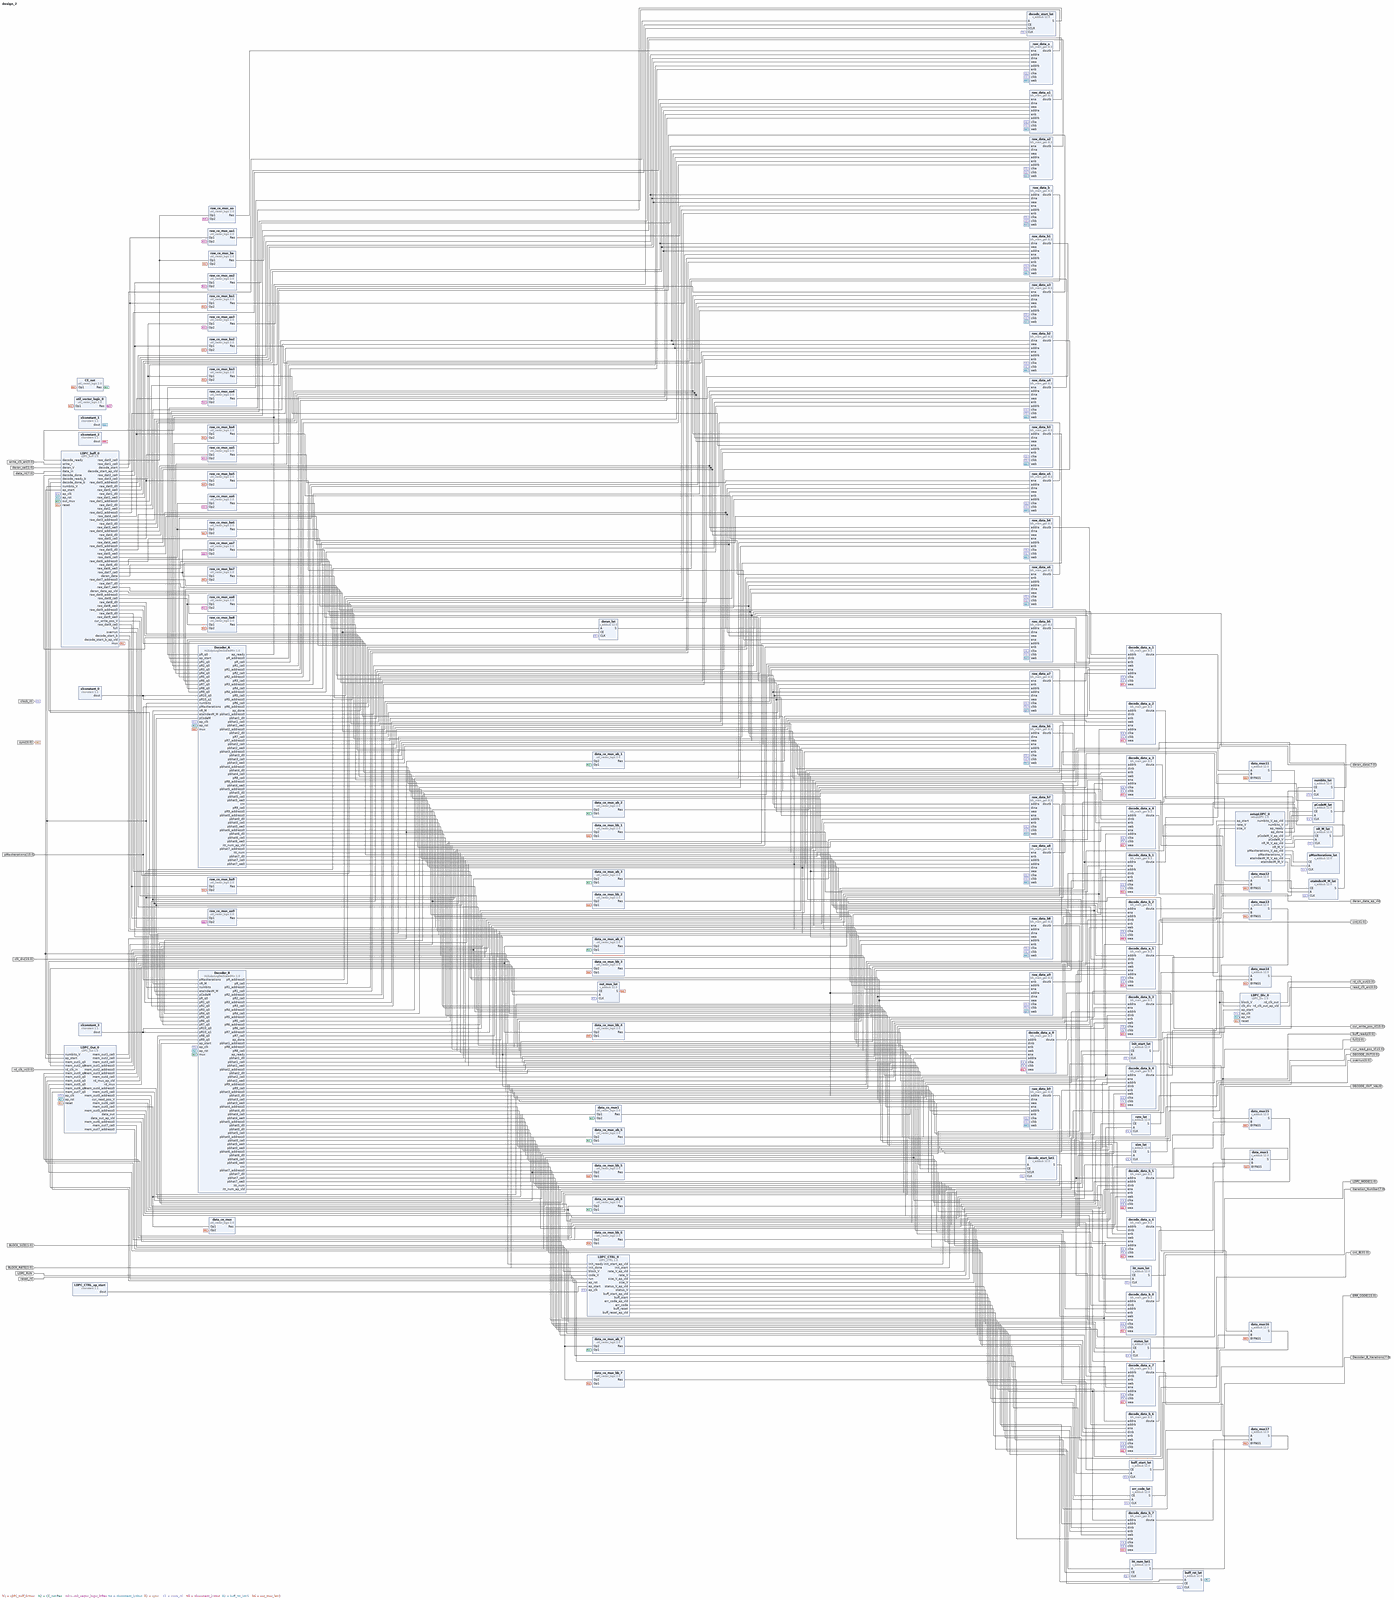
[diagram p0: block diagram of the top level, whole]
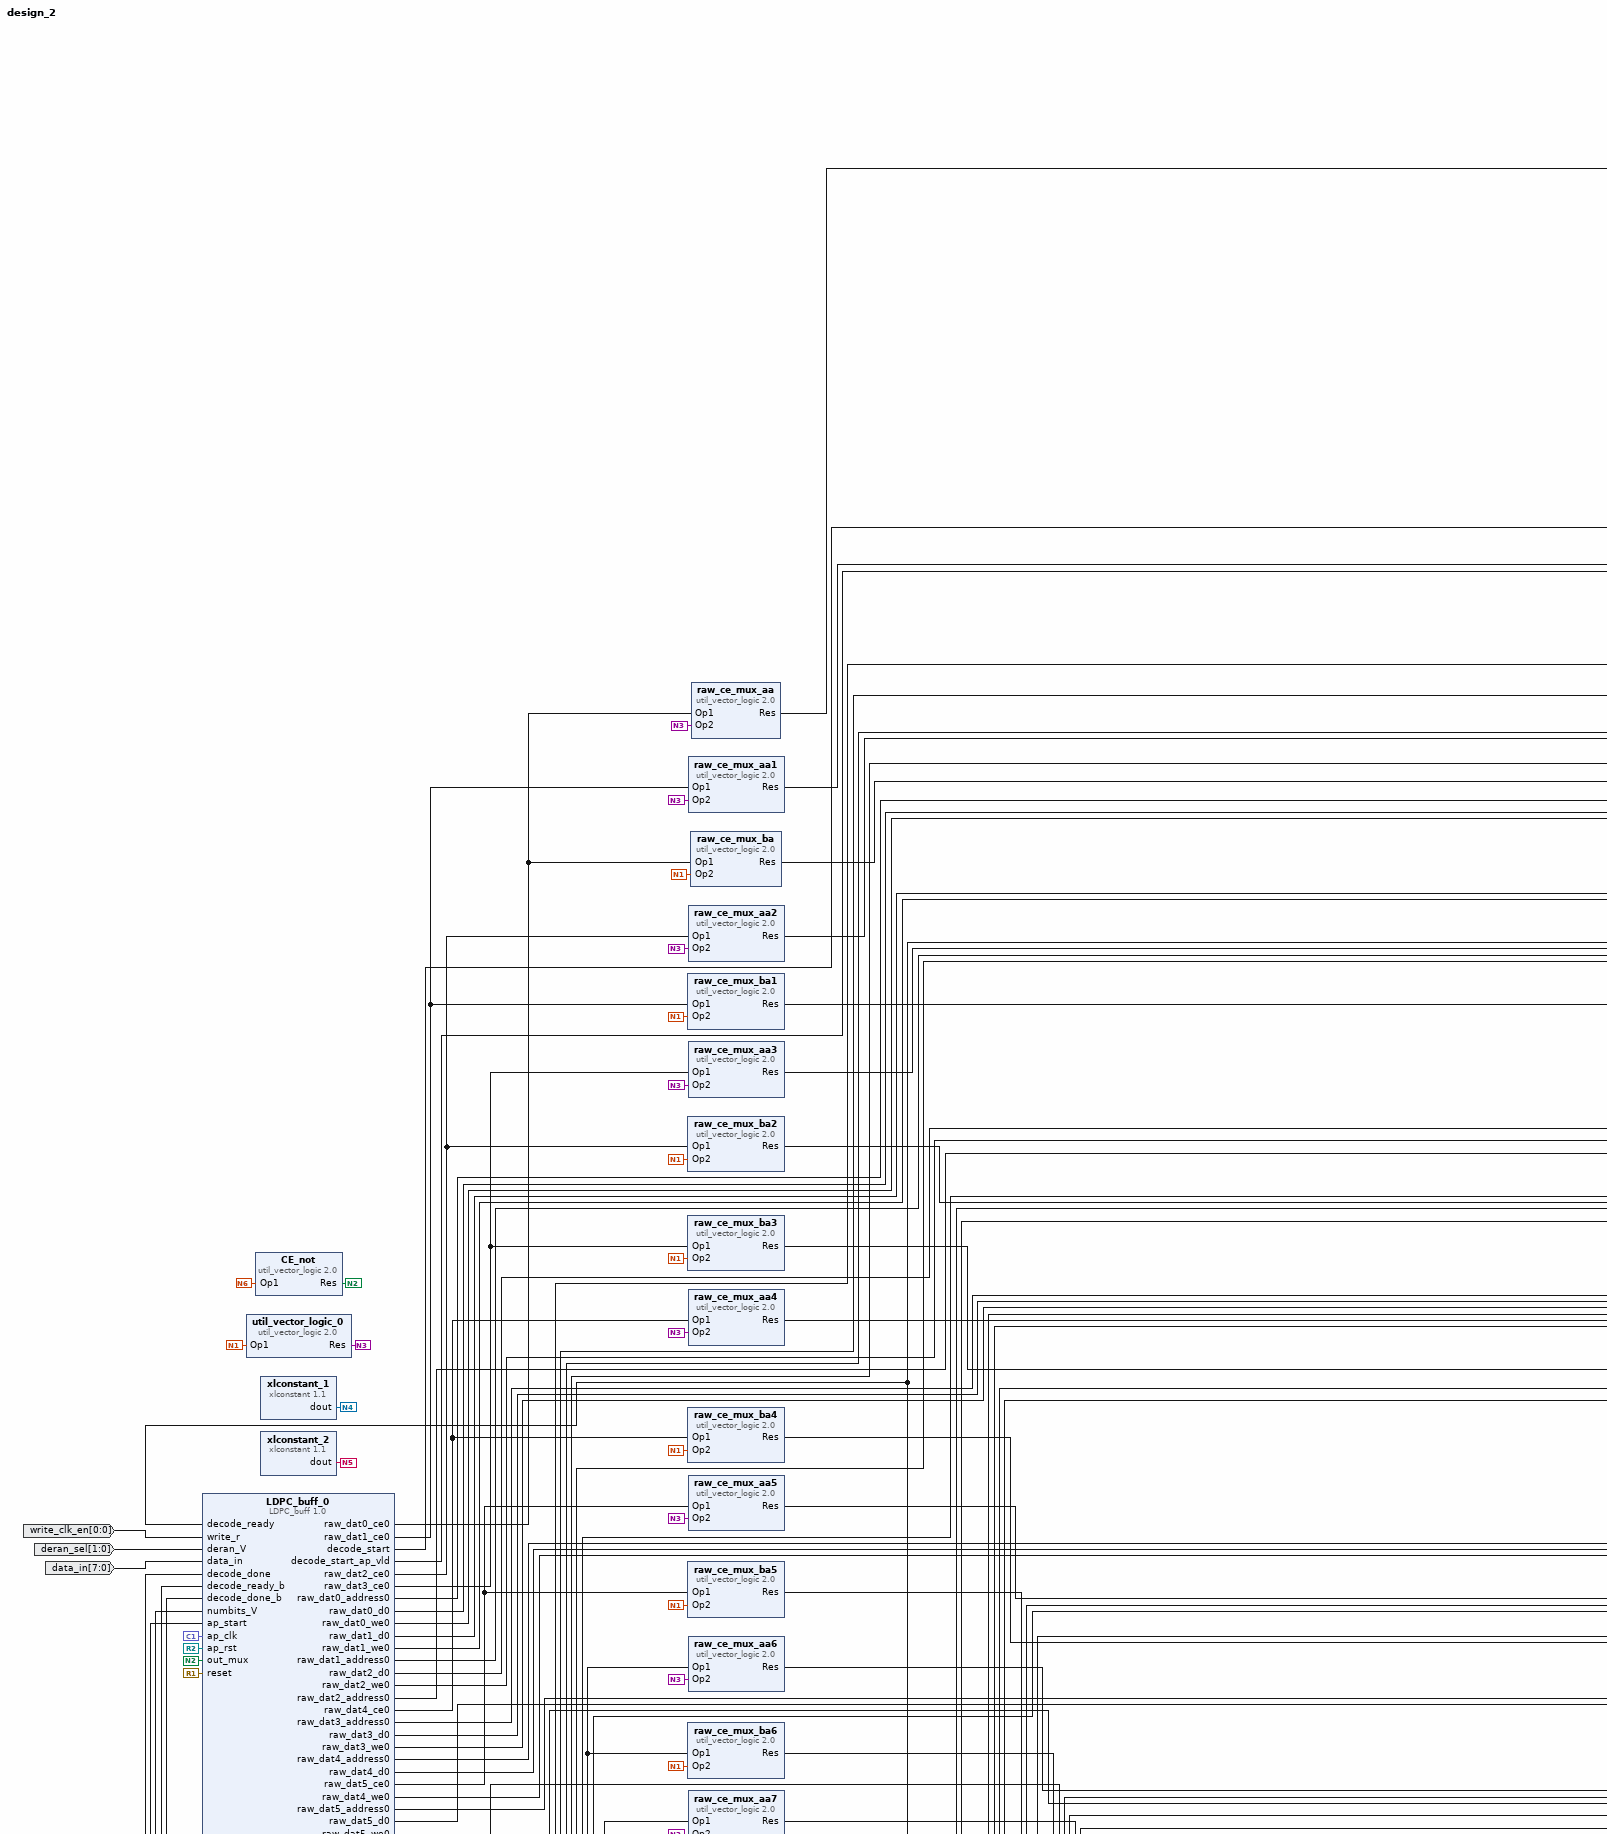
[diagram p1: block diagram of the top level, upper left part]
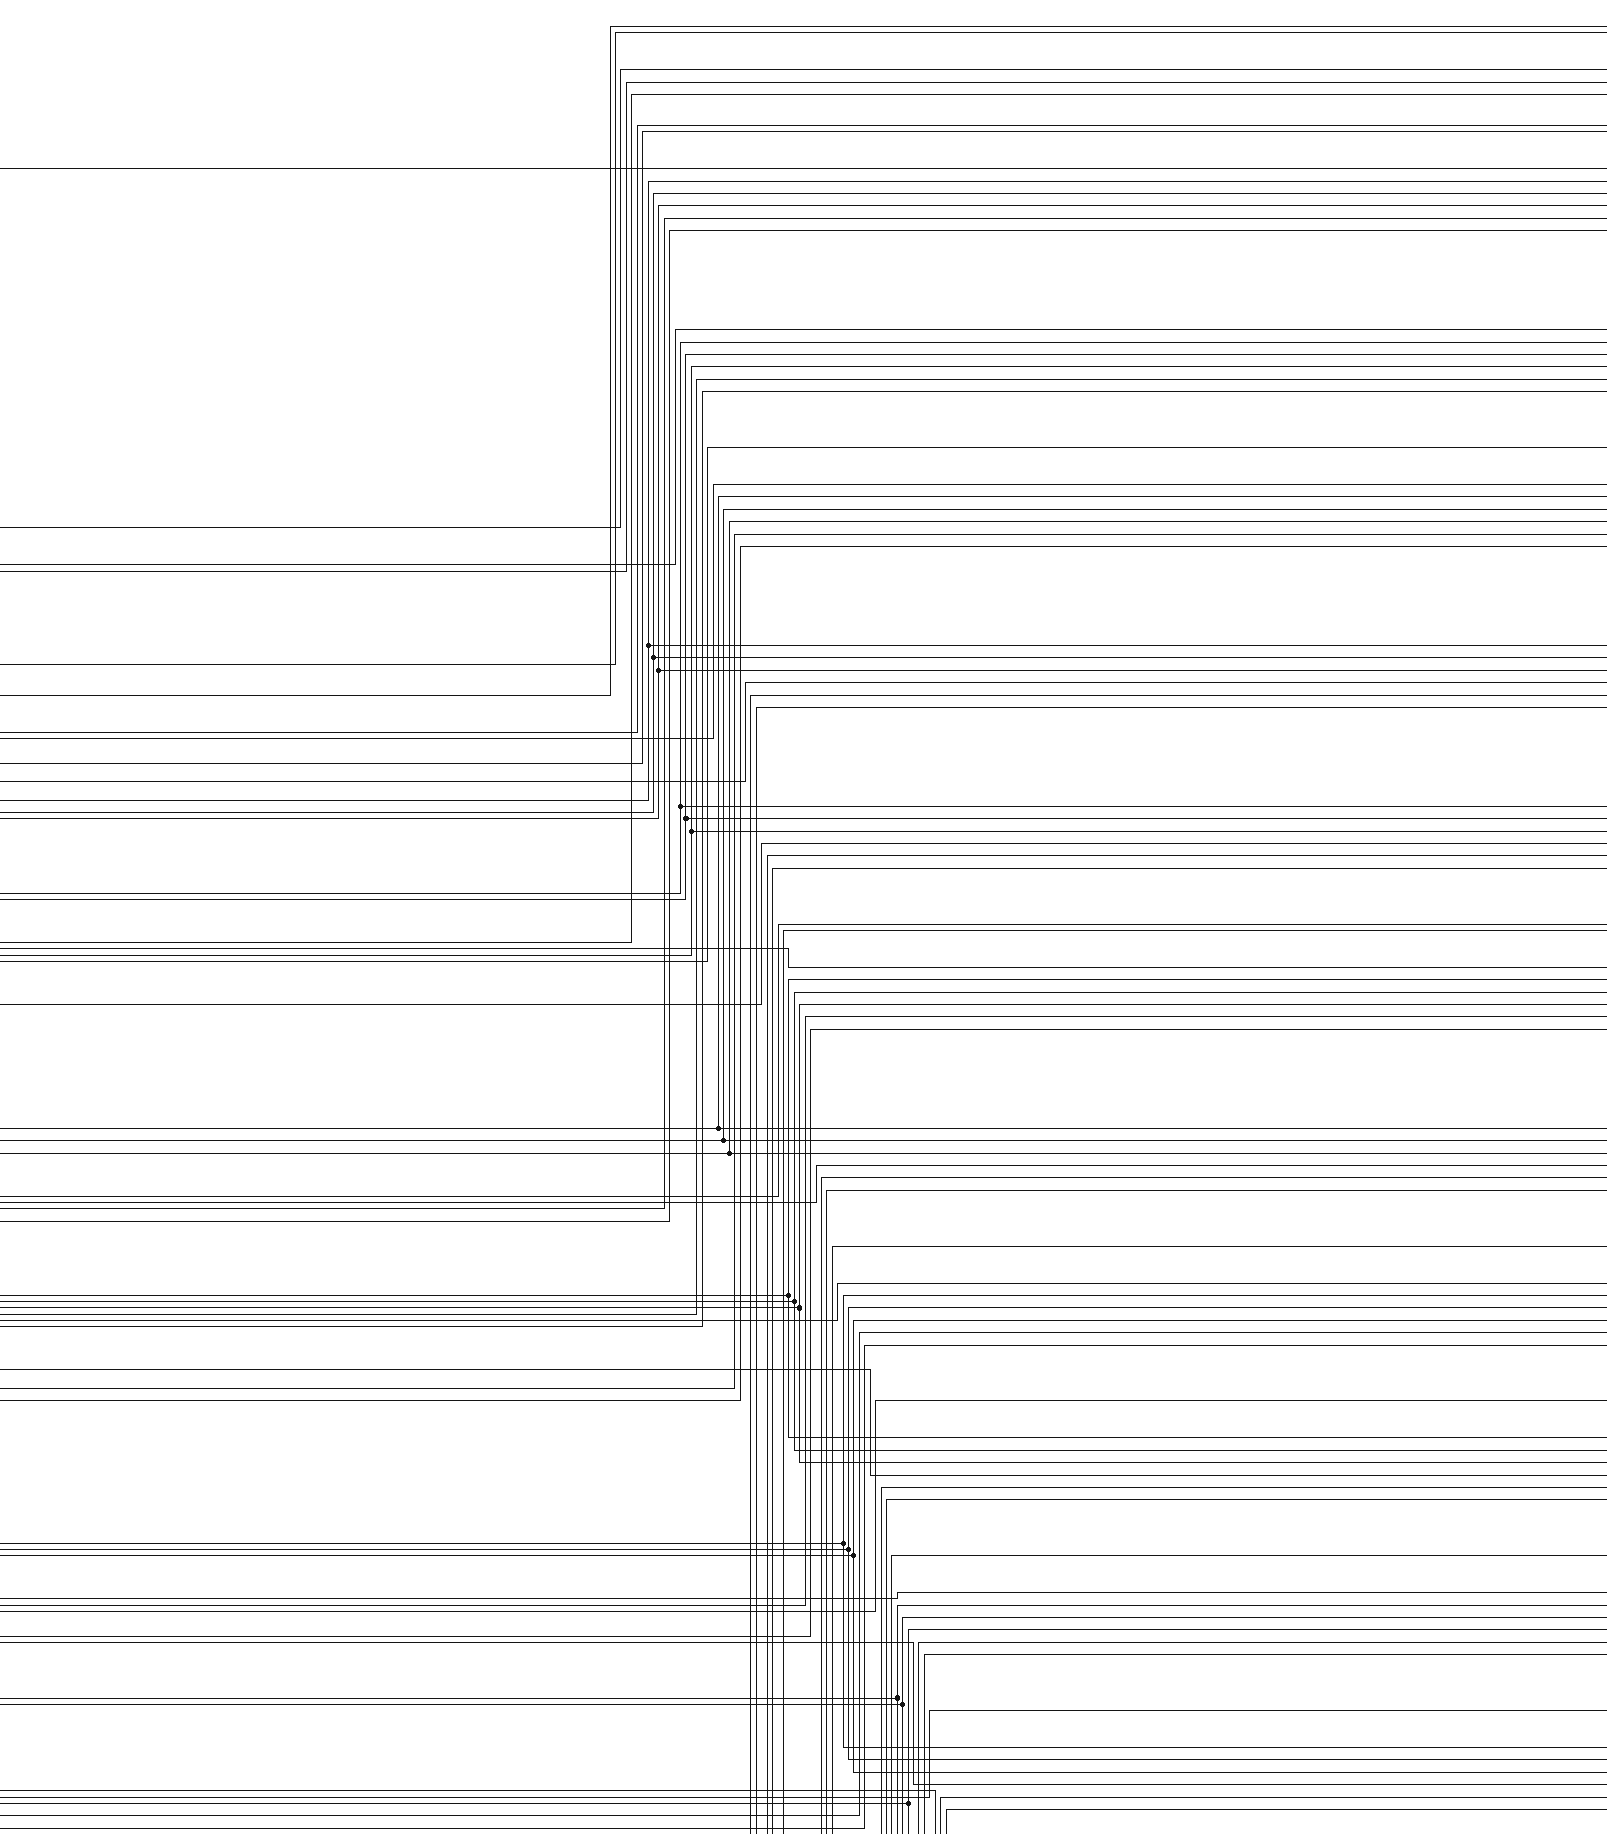
[diagram p2: block diagram of the top level, upper centre part]
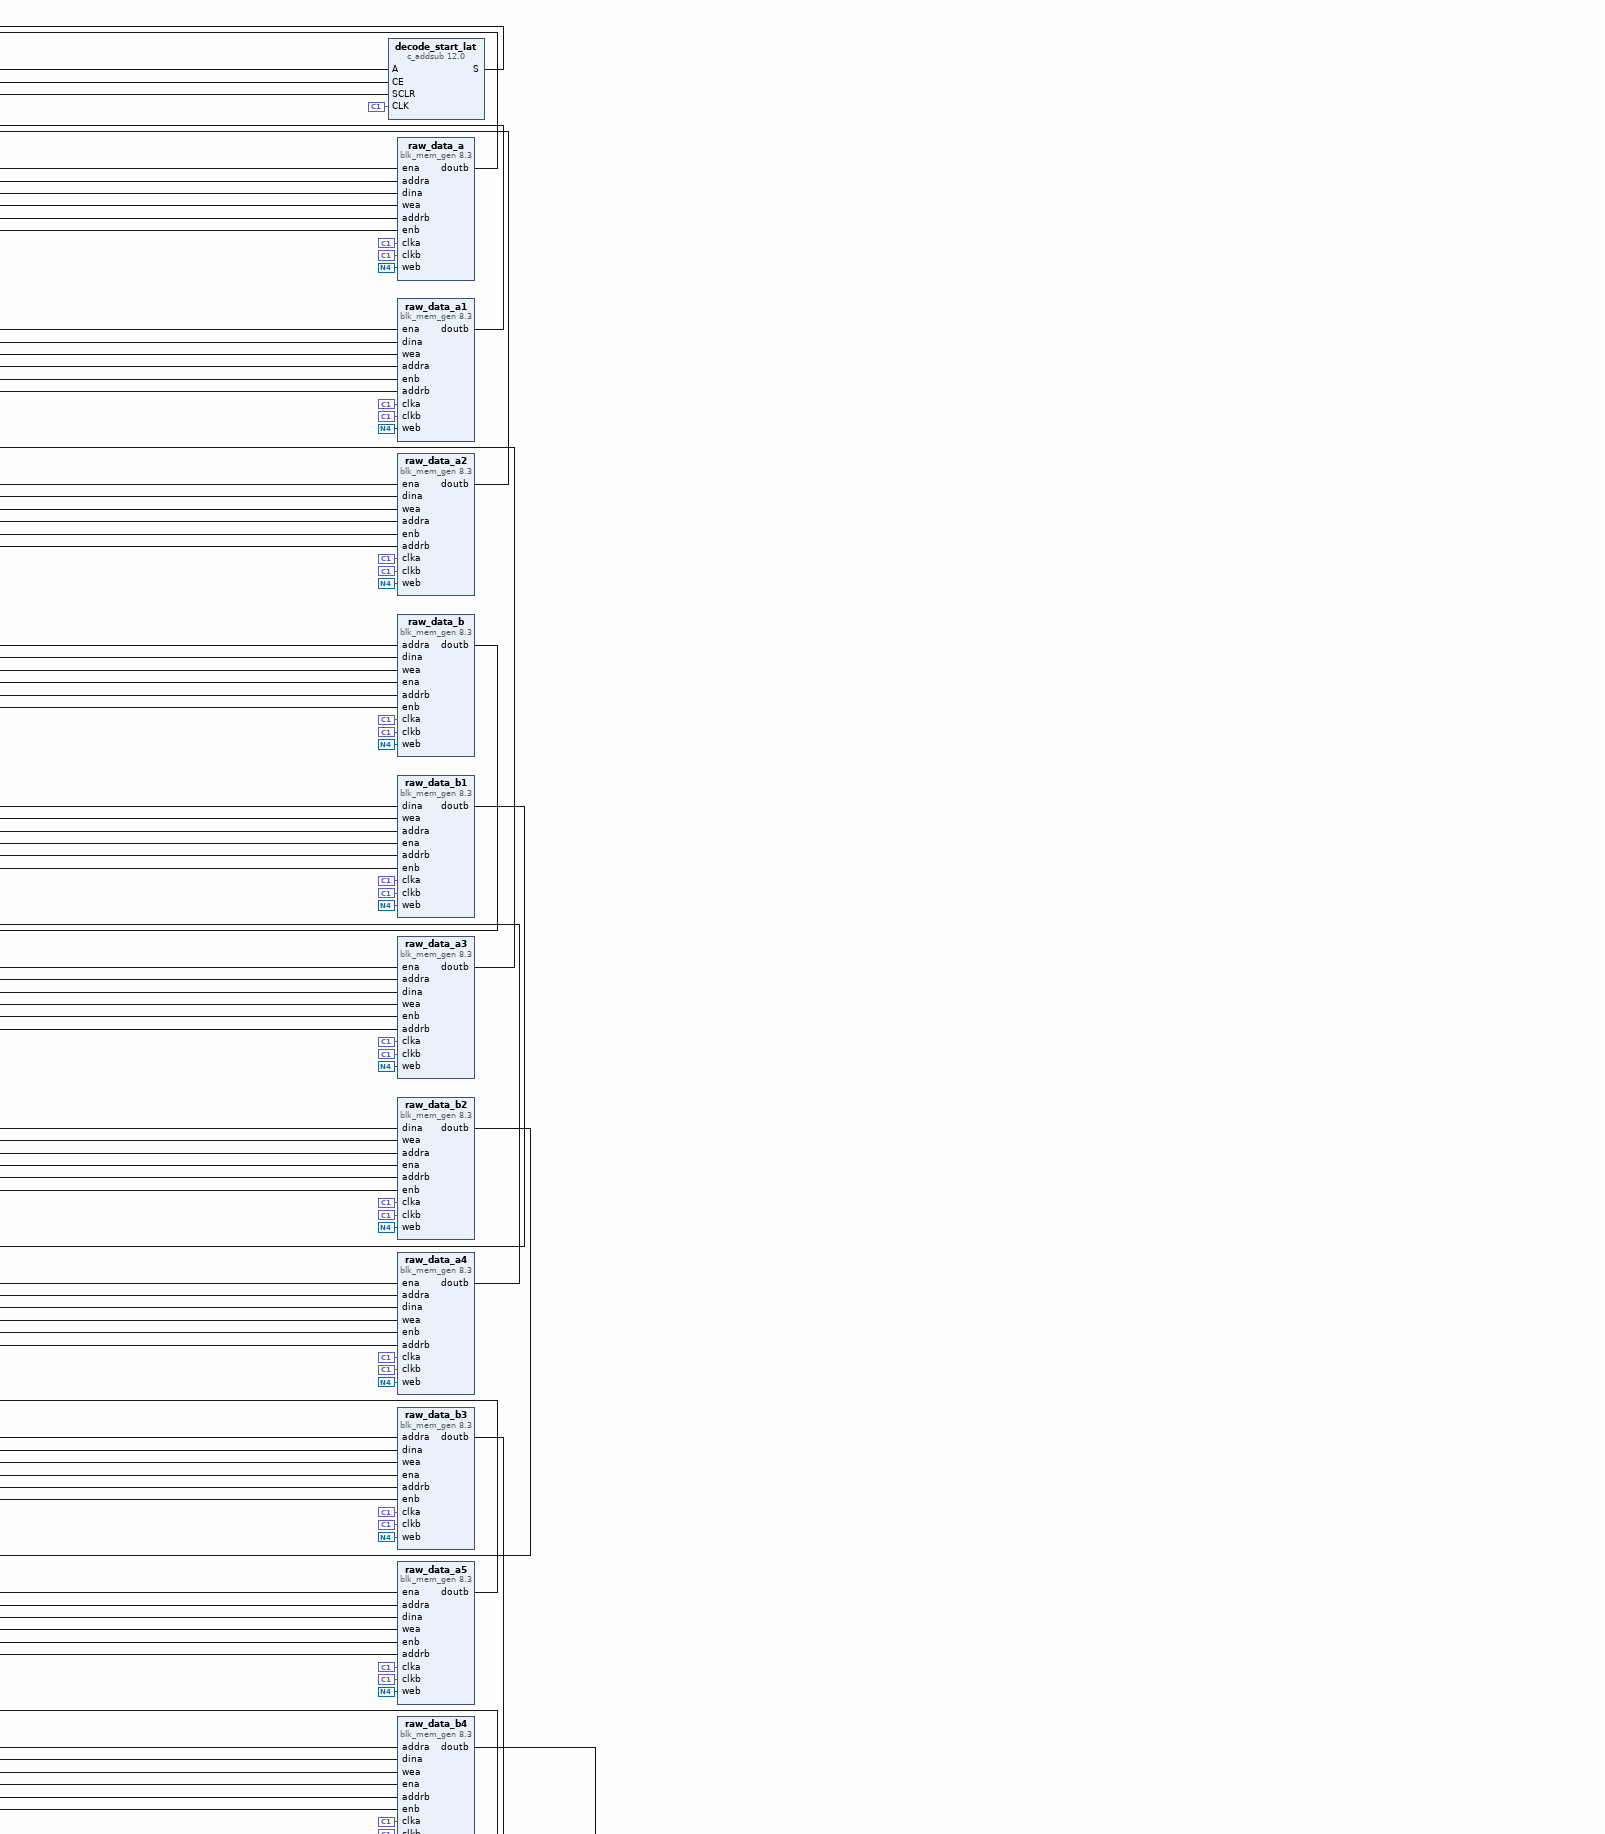
[diagram p3: block diagram of the top level, upper right part]
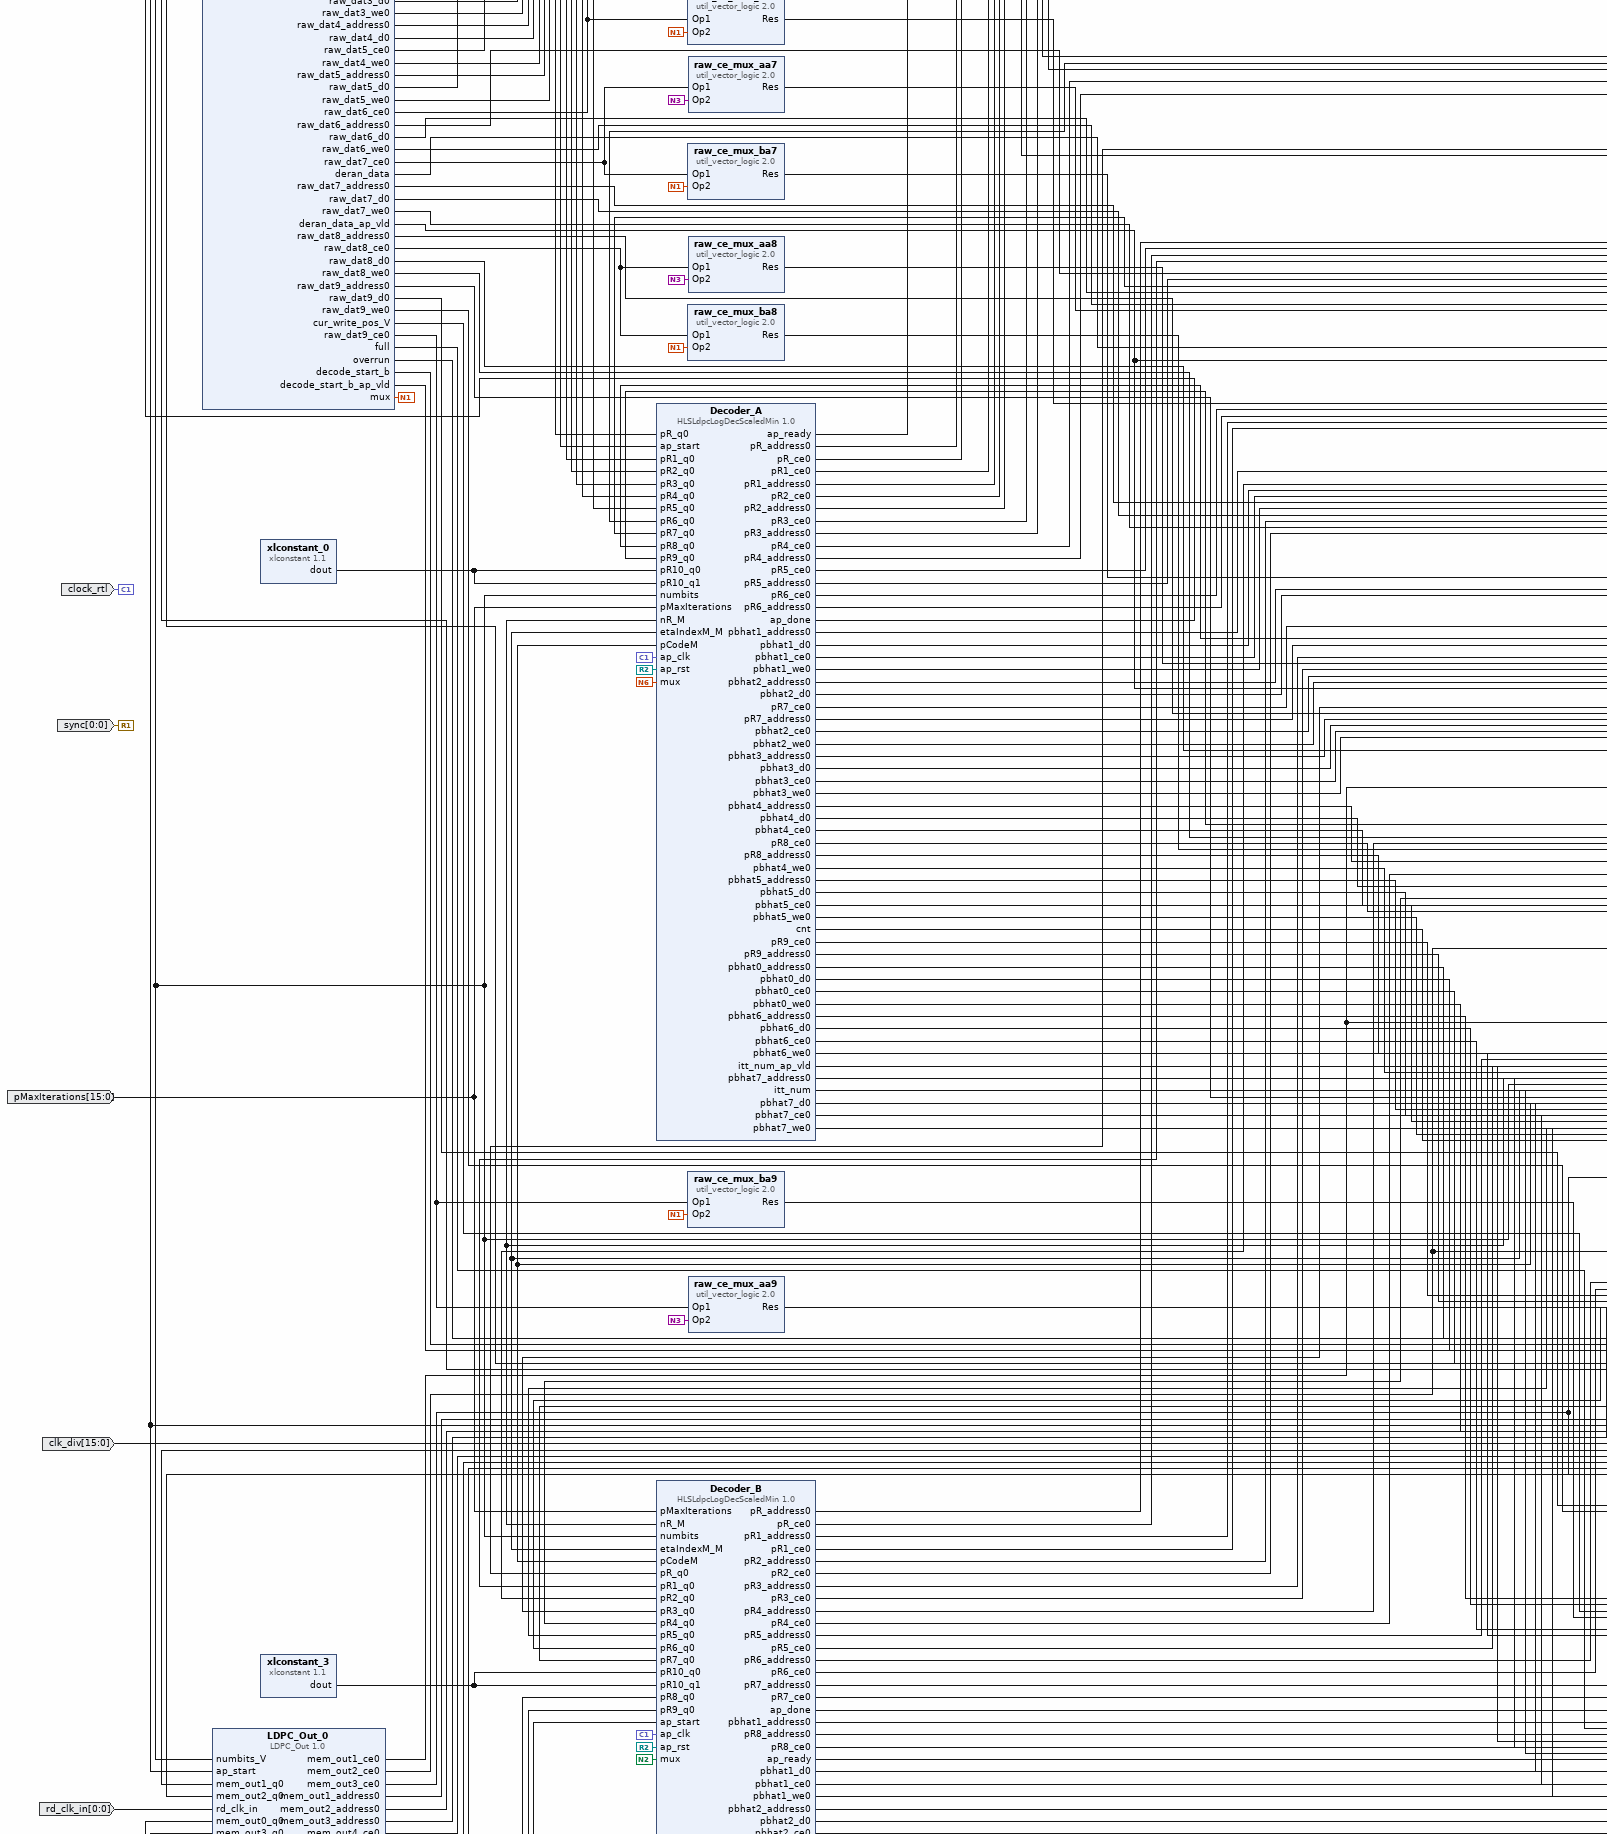
[diagram p4: block diagram of the top level, middle left part]
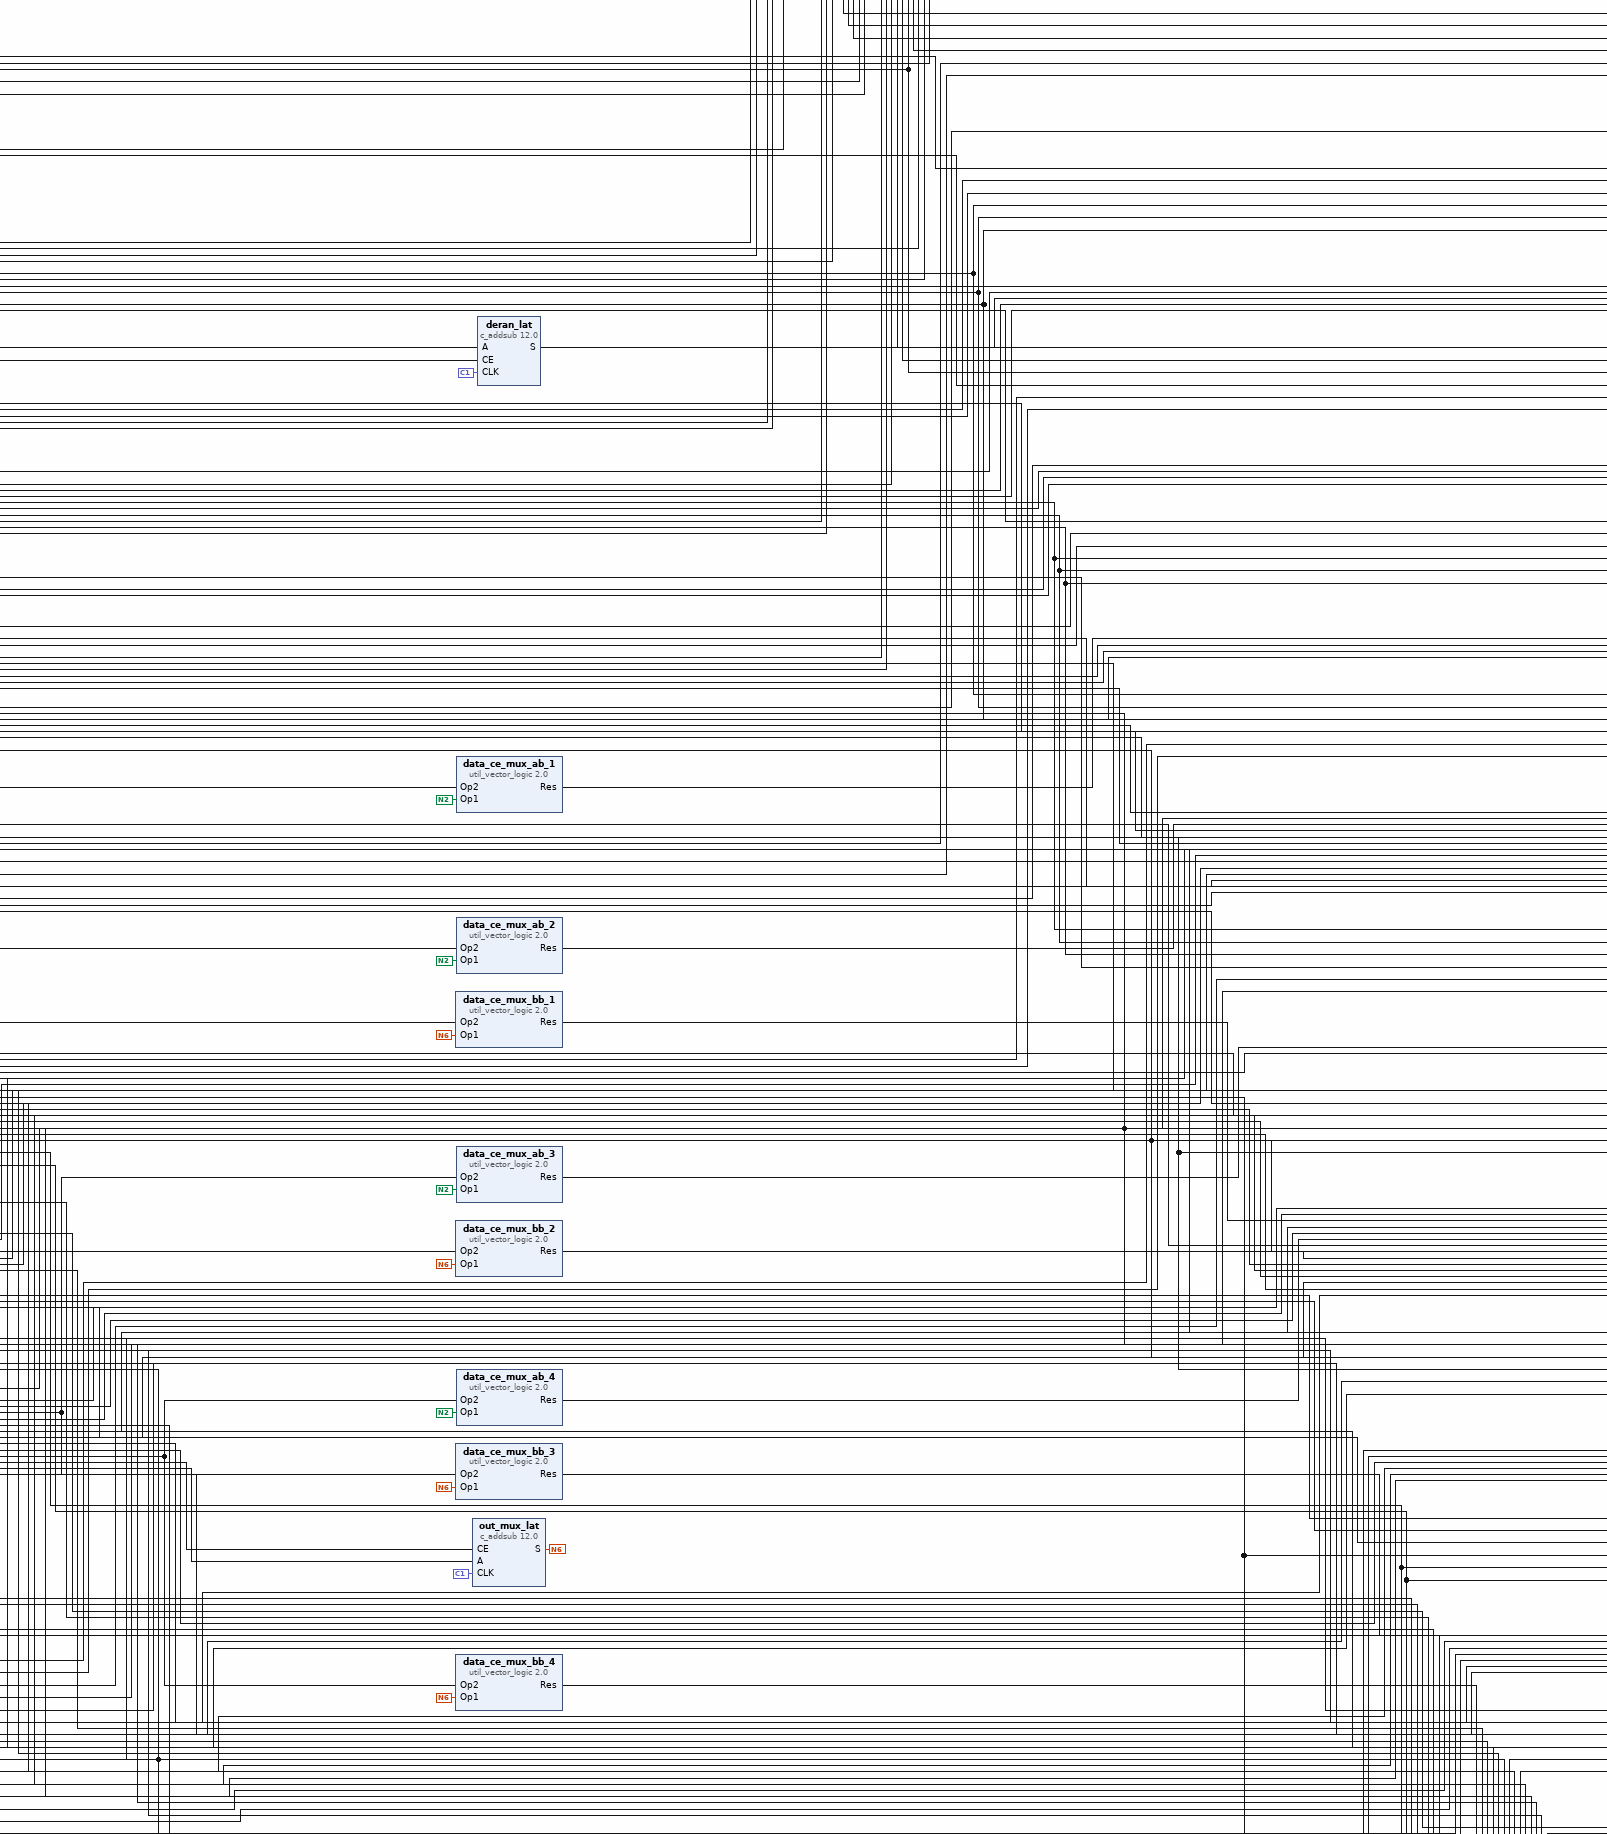
[diagram p5: block diagram of the top level, middle centre part]
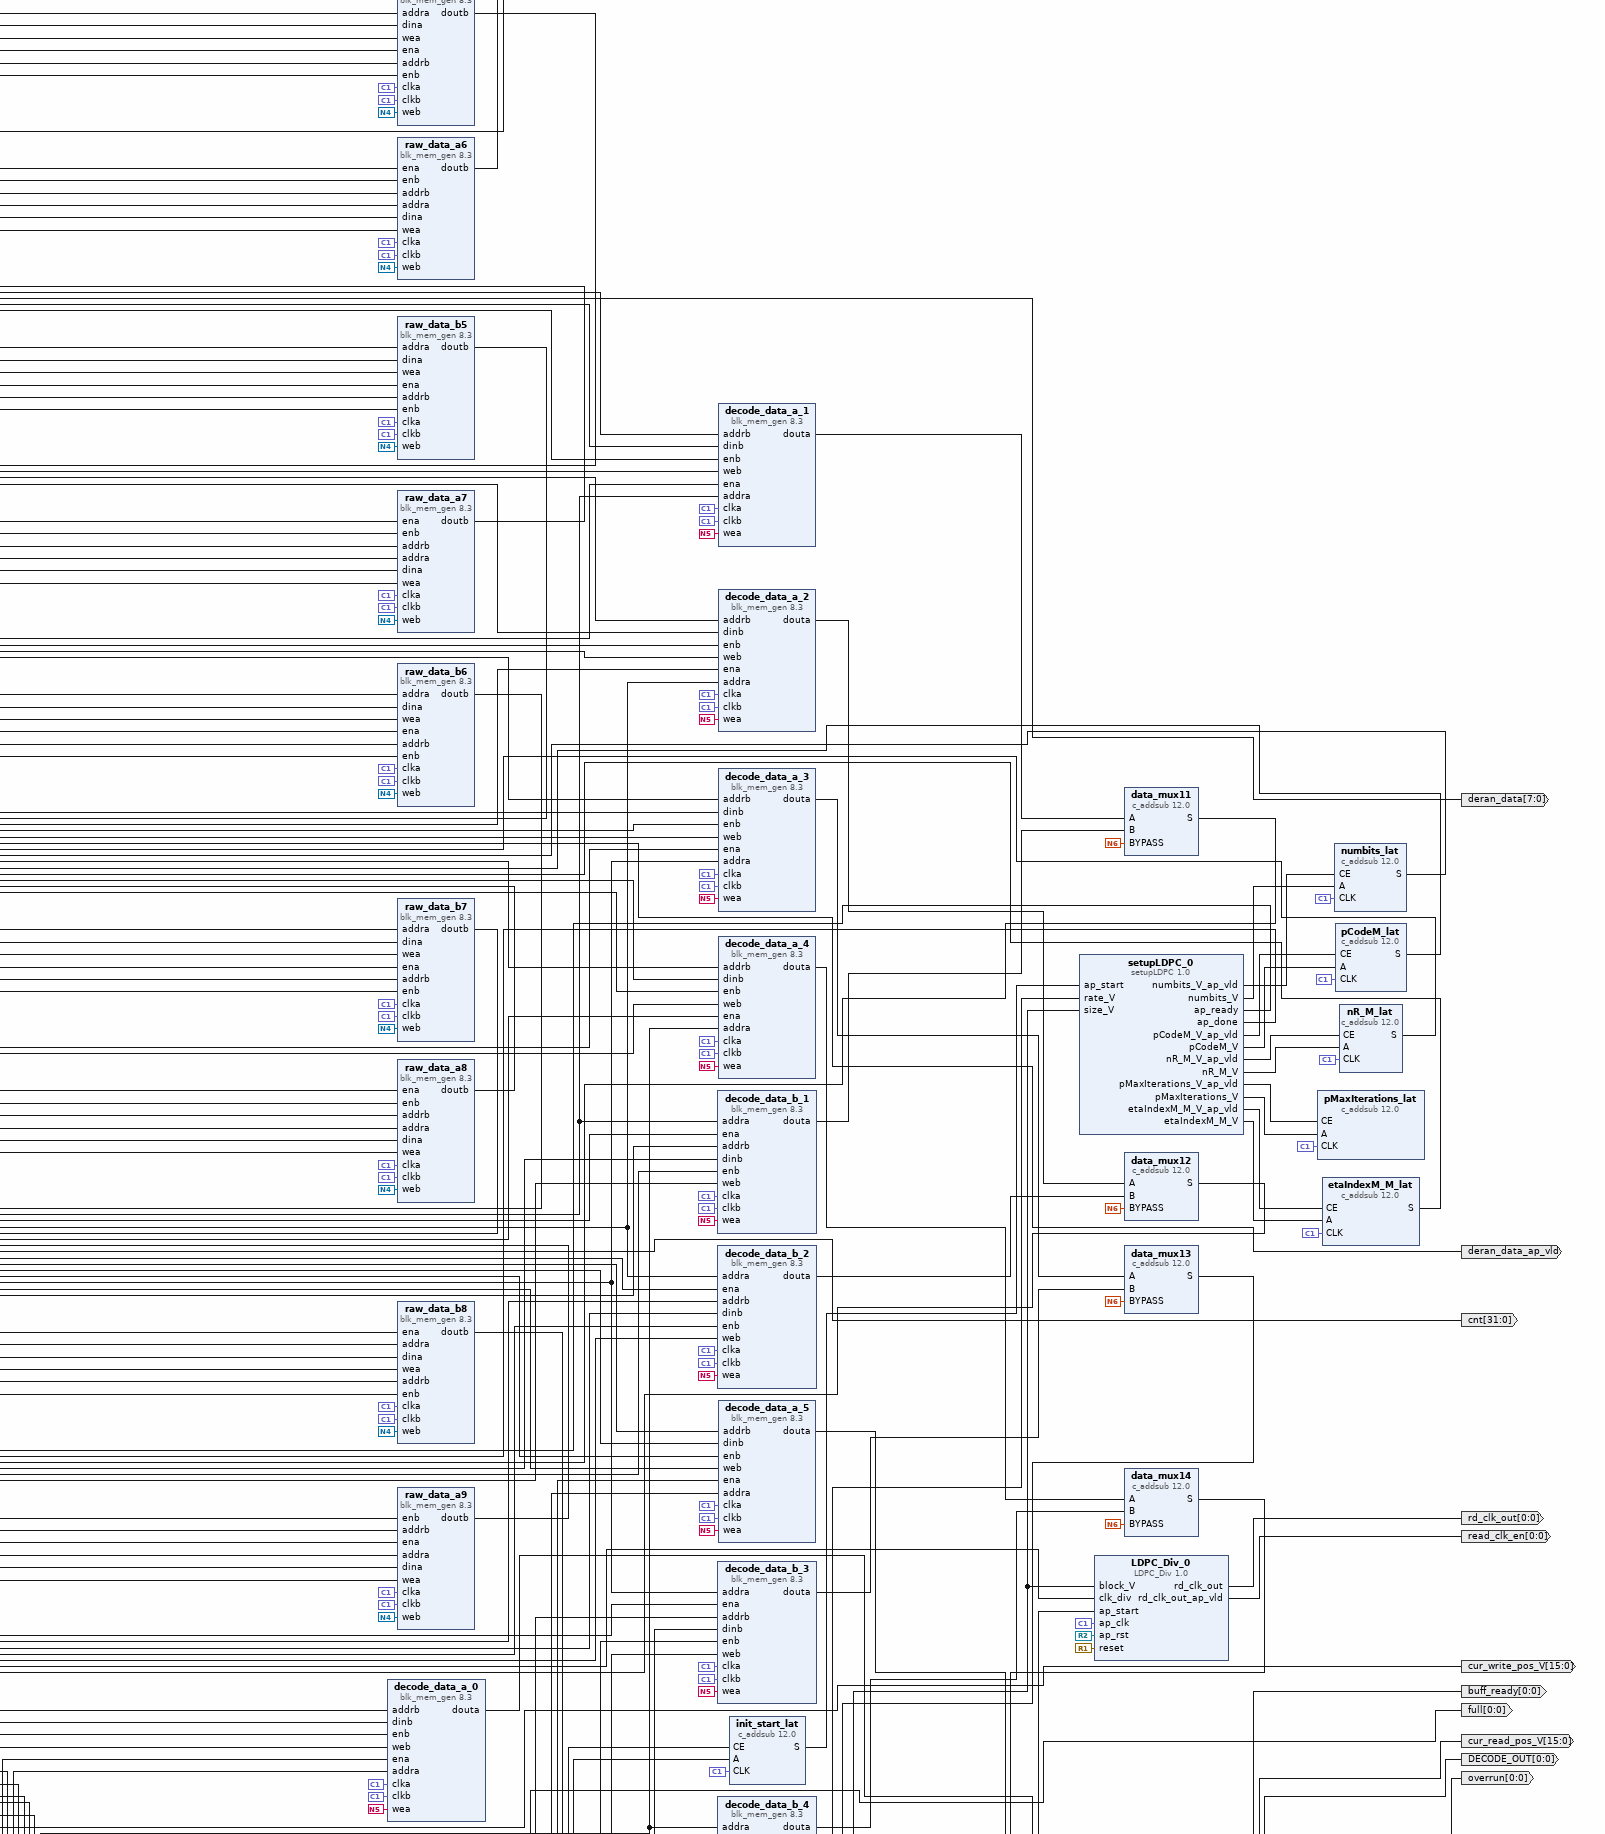
[diagram p6: block diagram of the top level, middle right part]
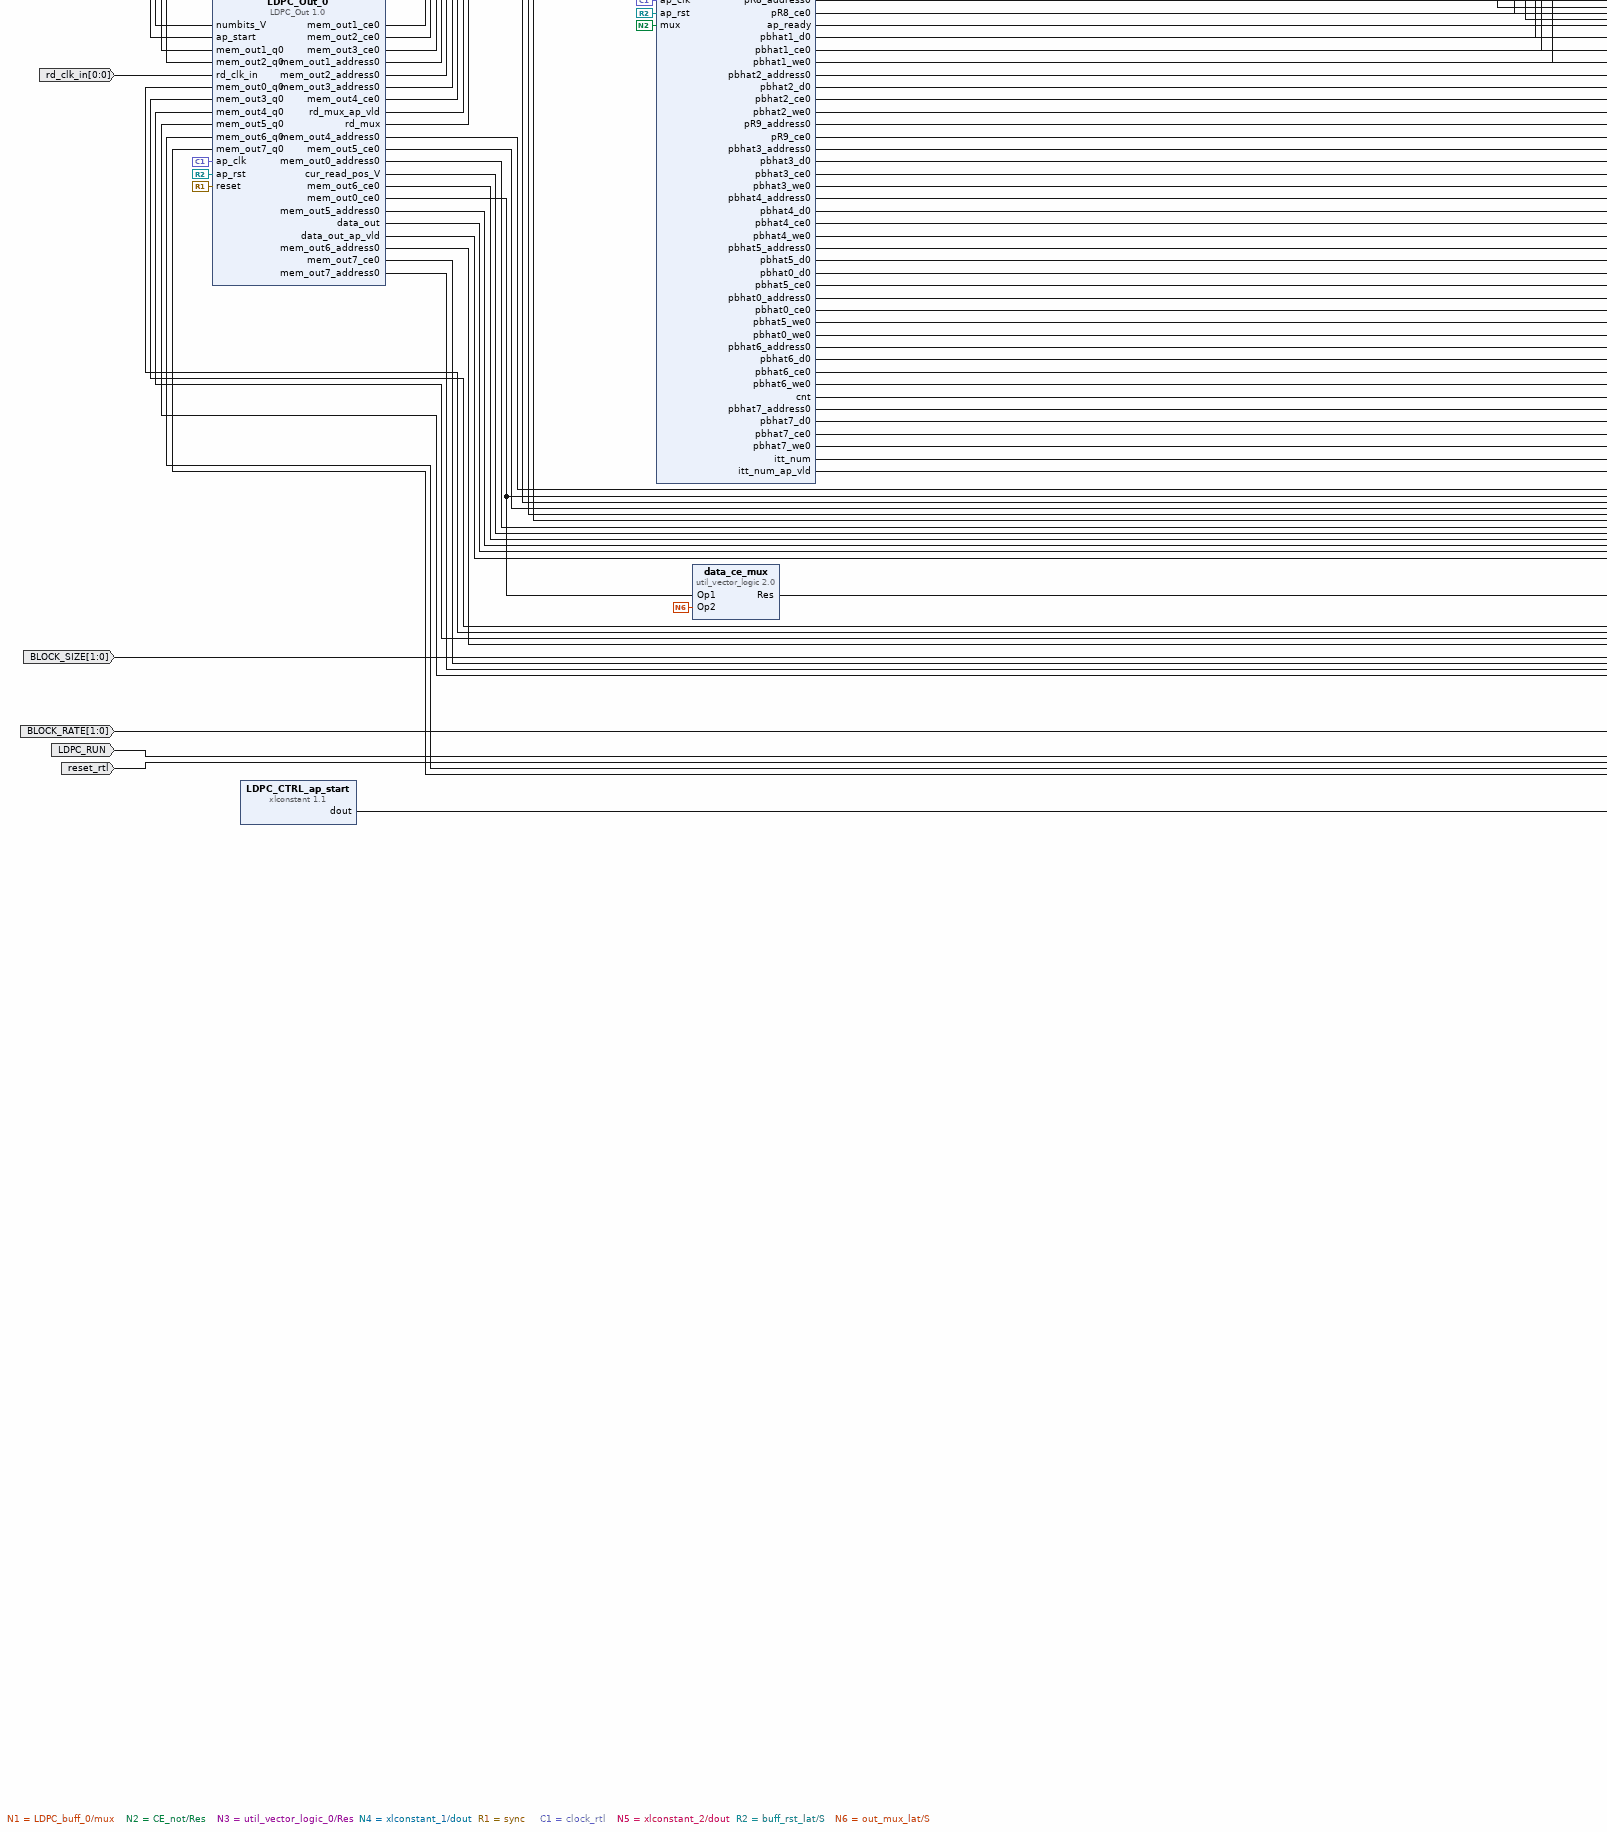
[diagram p7: block diagram of the top level, lower left part]
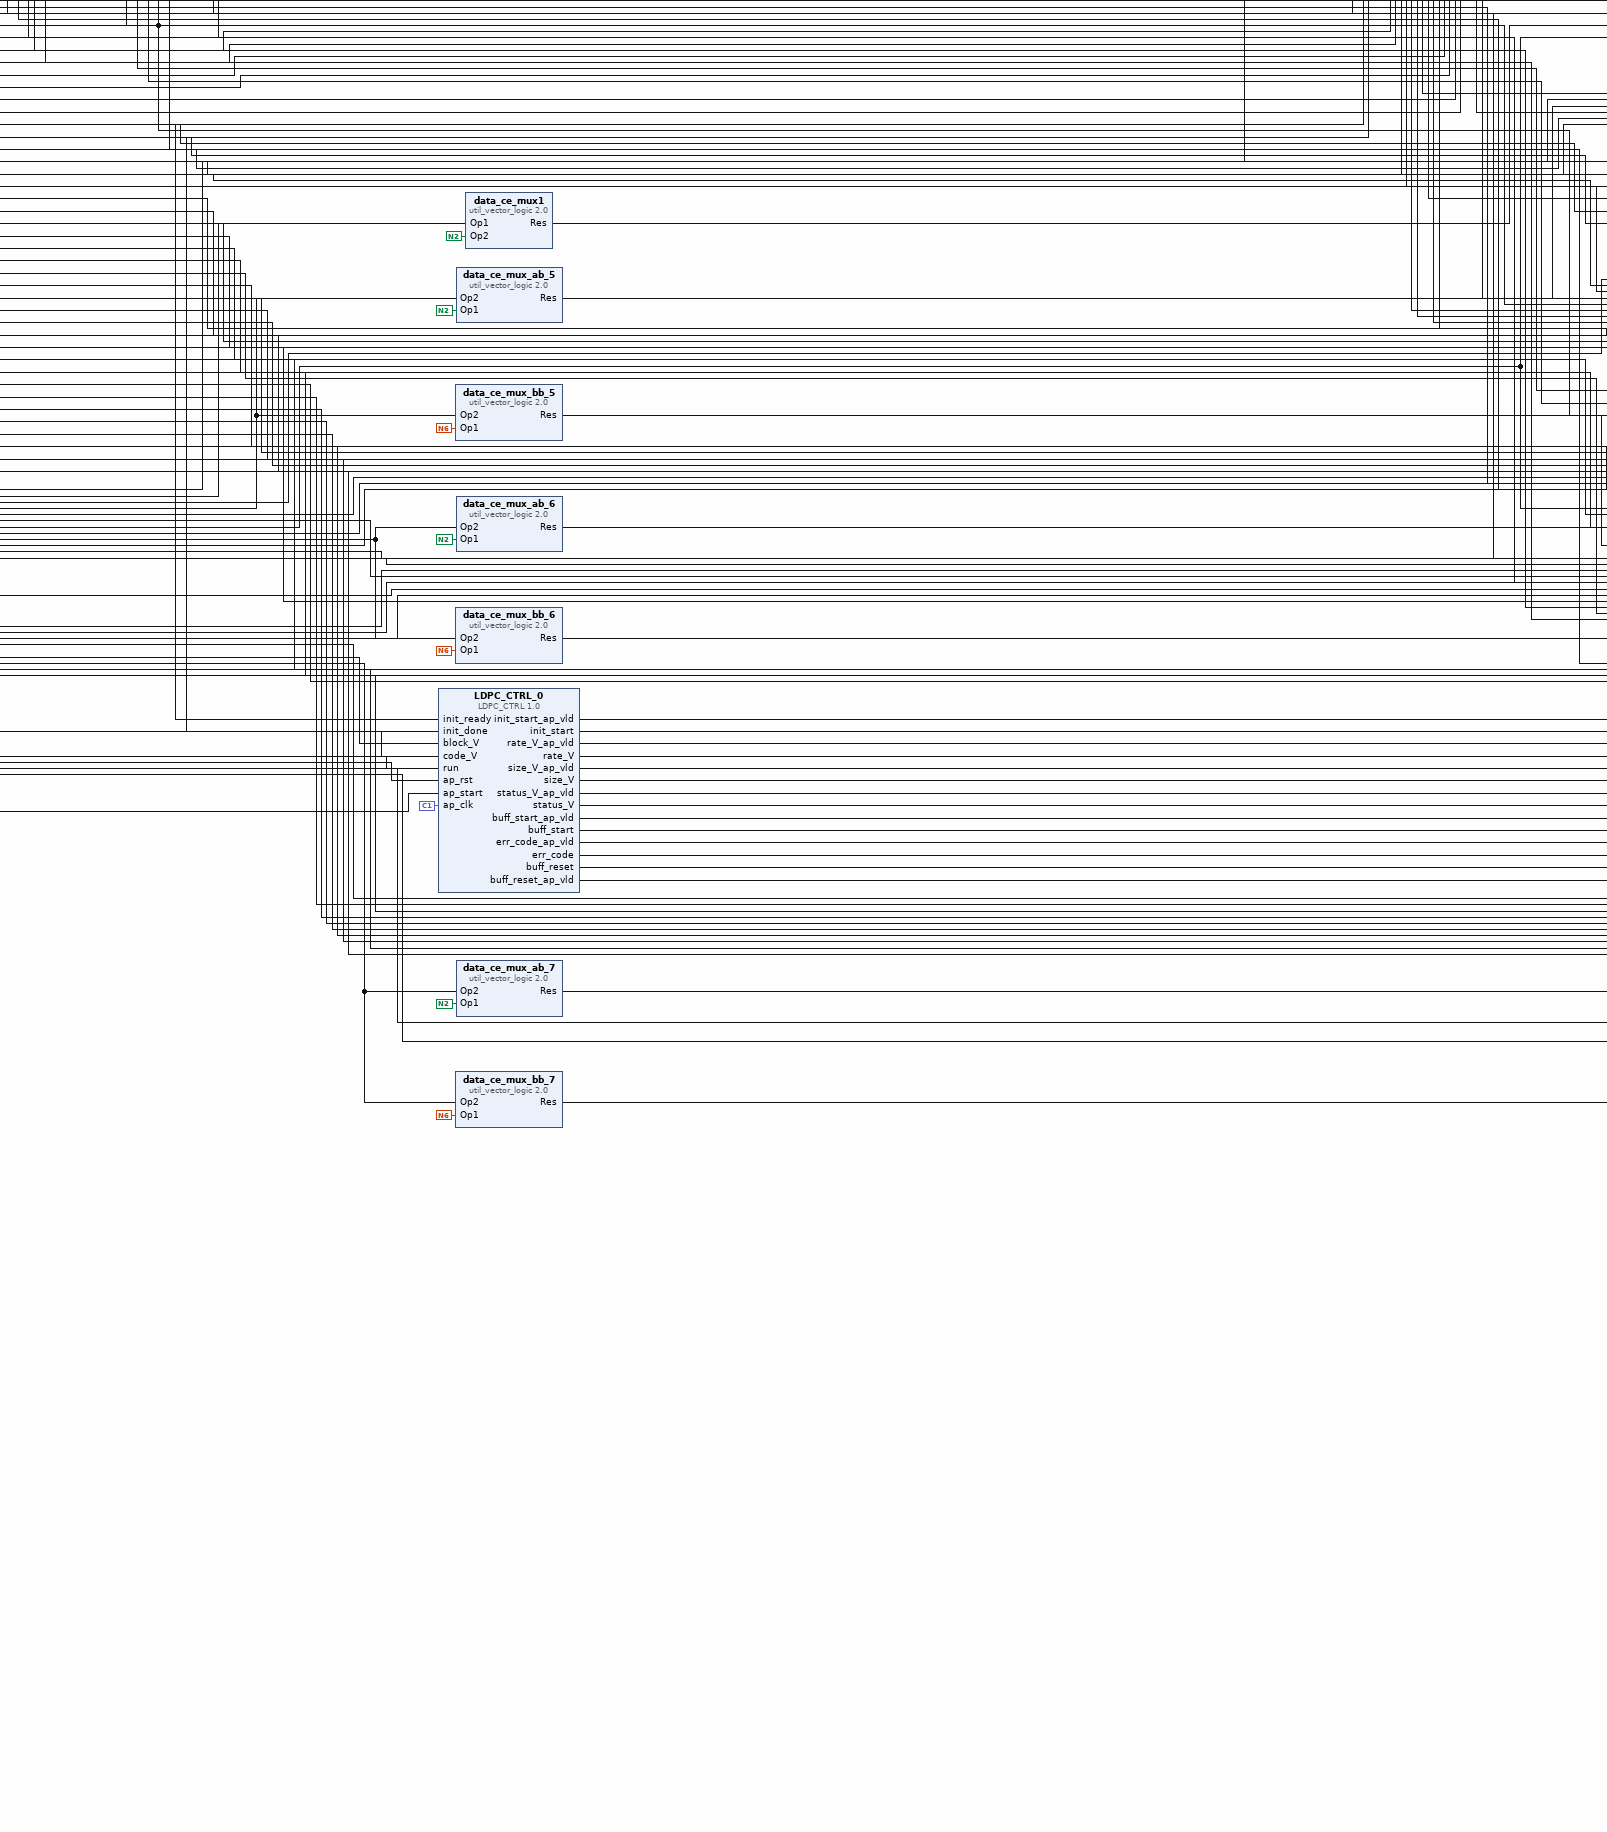
[diagram p8: block diagram of the top level, lower centre part]
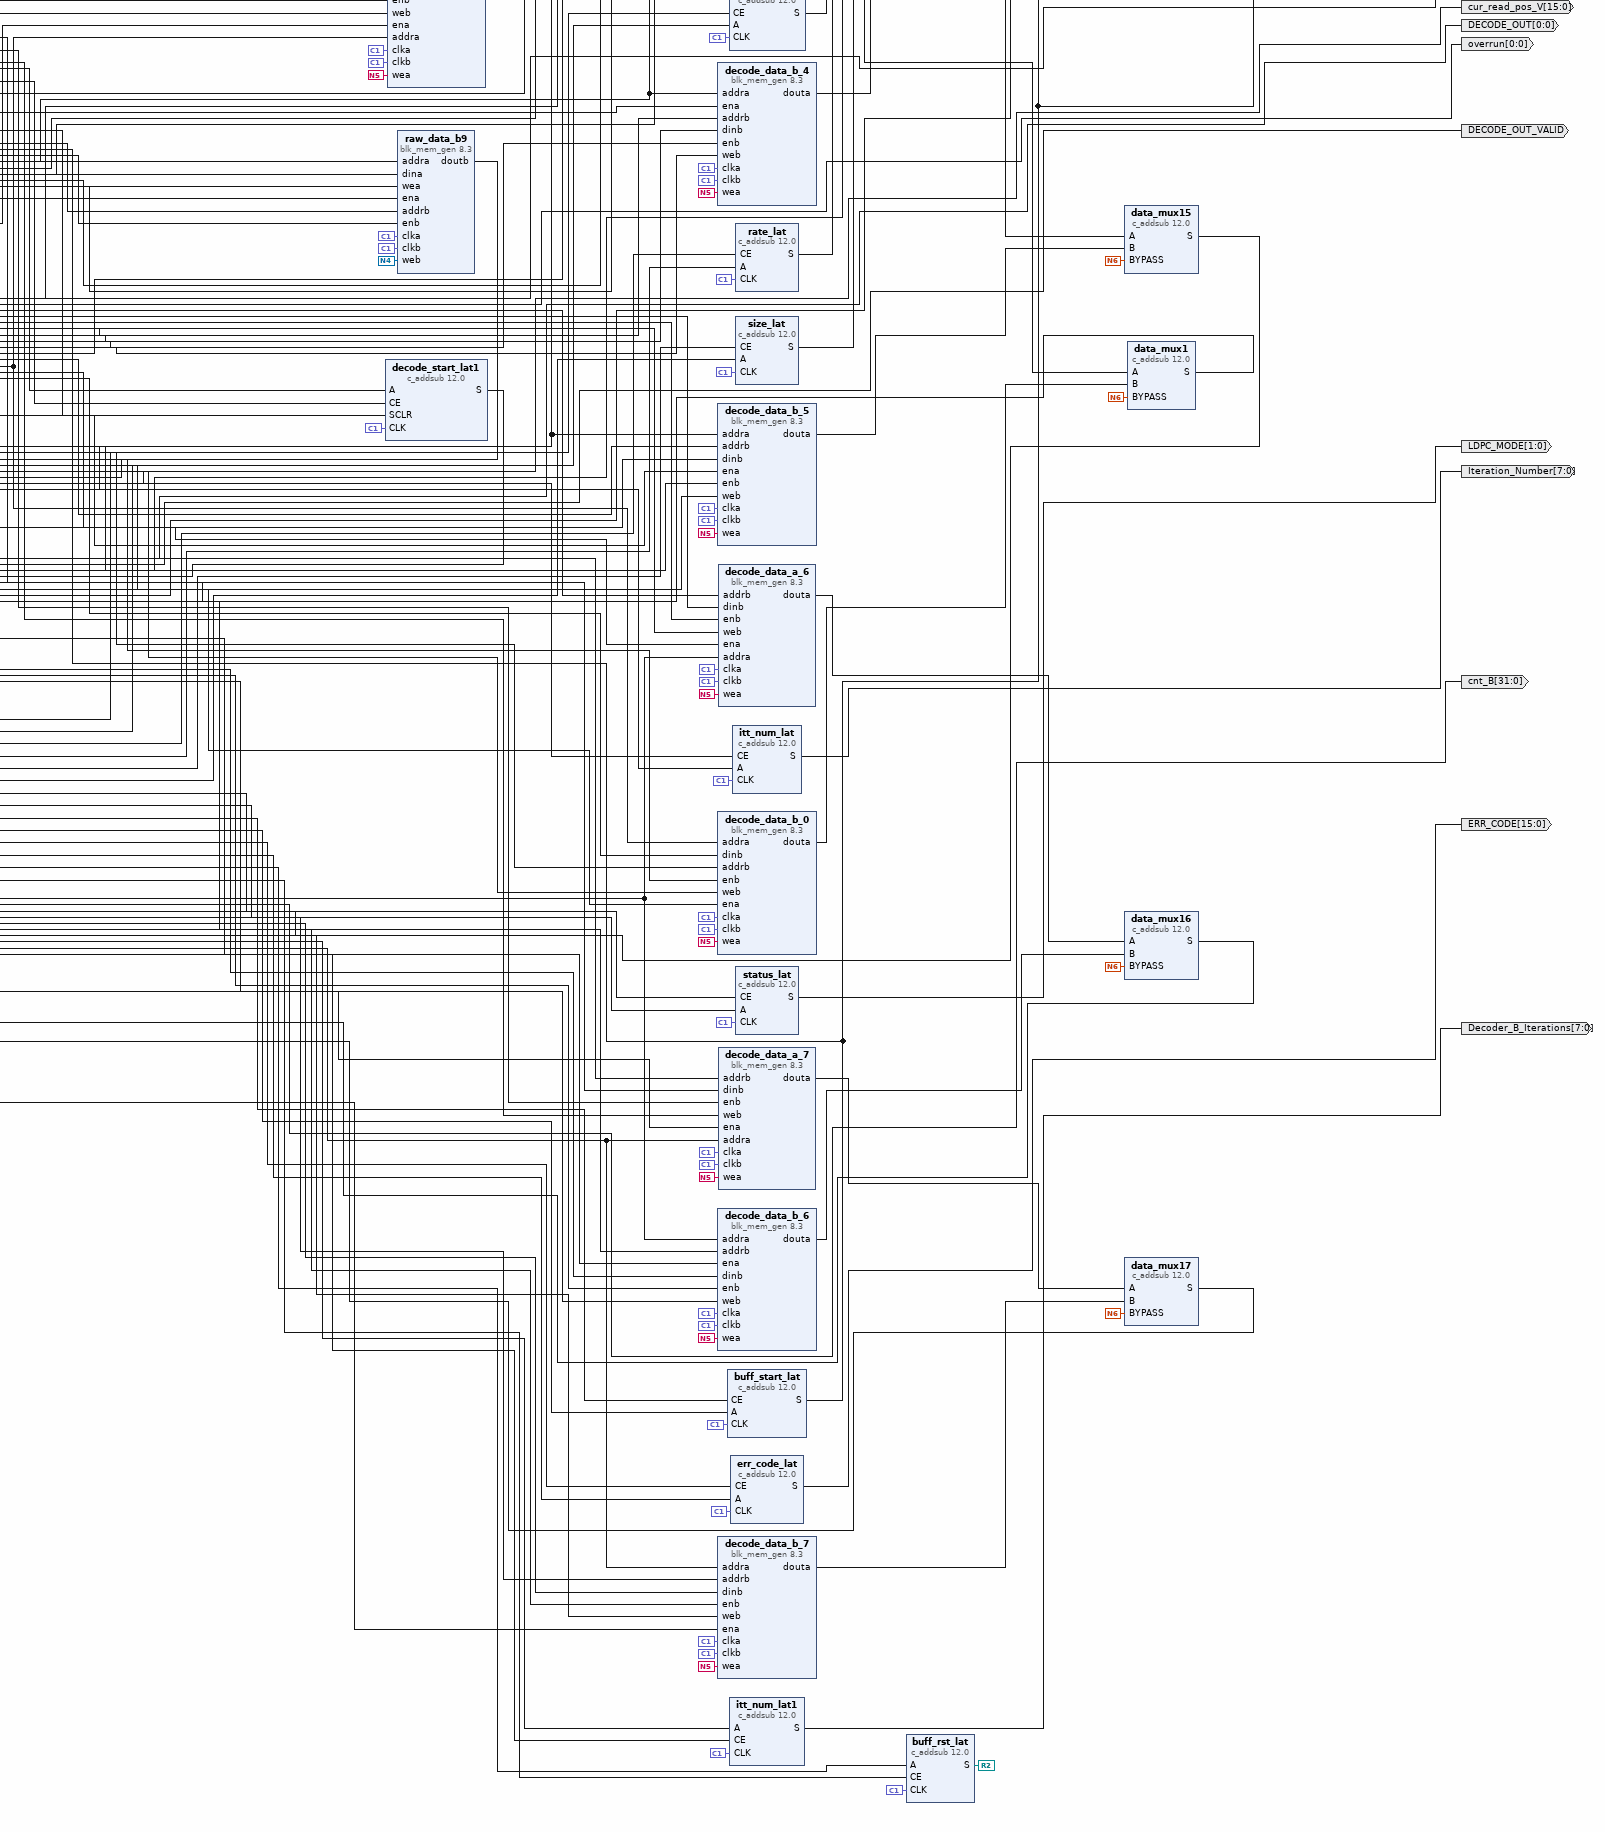
[diagram p9: block diagram of the top level, lower right part]
# Vivado block design design_2, xc7k160tfbg676-1, Vivado 2016.3
create_bd_design design_2

create_bd_port -dir I -from 1 -to 0 BLOCK_SIZE
create_bd_port -dir I -from 1 -to 0 BLOCK_RATE
create_bd_port -dir I LDPC_RUN
create_bd_port -dir O -from 31 -to 0 -type data cnt
create_bd_port -dir I -type rst reset_rtl
set_property -dict {CONFIG.POLARITY ACTIVE_HIGH} [get_bd_ports reset_rtl]
create_bd_port -dir I -from 15 -to 0 -type data clk_div
set_property -dict [list \
  CONFIG.LAYERED_METADATA {xilinx.com:interface:datatypes:1.0 {DATA {datatype {name {attribs {resolve_type immediate dependency {} format string minimum {} maximum {}} value {}} bitwidth {attribs {resolve_type immediate dependency {} format long minimum {} maximum {}} value 16} bitoffset {attribs {resolve_type immediate dependency {} format long minimum {} maximum {}} value 0} integer {signed {attribs {resolve_type immediate dependency {} format bool minimum {} maximum {}} value true}}}}}} \
] [get_bd_ports clk_div]
create_bd_port -dir I -from 0 -to 0 -type data write_clk_en
set_property -dict [list \
  CONFIG.LAYERED_METADATA {xilinx.com:interface:datatypes:1.0 {DATA {datatype {name {attribs {resolve_type immediate dependency {} format string minimum {} maximum {}} value {}} bitwidth {attribs {resolve_type immediate dependency {} format long minimum {} maximum {}} value 1} bitoffset {attribs {resolve_type immediate dependency {} format long minimum {} maximum {}} value 0}}}}} \
] [get_bd_ports write_clk_en]
create_bd_port -dir I -from 1 -to 0 -type data deran_sel
set_property -dict [list \
  CONFIG.LAYERED_METADATA {xilinx.com:interface:datatypes:1.0 {DATA {datatype {name {attribs {resolve_type immediate dependency {} format string minimum {} maximum {}} value {}} bitwidth {attribs {resolve_type immediate dependency {} format long minimum {} maximum {}} value 2} bitoffset {attribs {resolve_type immediate dependency {} format long minimum {} maximum {}} value 0} integer {signed {attribs {resolve_type immediate dependency {} format bool minimum {} maximum {}} value false}}}}}} \
] [get_bd_ports deran_sel]
create_bd_port -dir I -from 0 -to 0 -type data sync
set_property -dict [list \
  CONFIG.LAYERED_METADATA {xilinx.com:interface:datatypes:1.0 {DATA {datatype {name {attribs {resolve_type immediate dependency {} format string minimum {} maximum {}} value {}} bitwidth {attribs {resolve_type immediate dependency {} format long minimum {} maximum {}} value 1} bitoffset {attribs {resolve_type immediate dependency {} format long minimum {} maximum {}} value 0}}}}} \
] [get_bd_ports sync]
create_bd_port -dir I -from 7 -to 0 -type data data_in
set_property -dict [list \
  CONFIG.LAYERED_METADATA {xilinx.com:interface:datatypes:1.0 {DATA {datatype {name {attribs {resolve_type immediate dependency {} format string minimum {} maximum {}} value {}} bitwidth {attribs {resolve_type immediate dependency {} format long minimum {} maximum {}} value 8} bitoffset {attribs {resolve_type immediate dependency {} format long minimum {} maximum {}} value 0} integer {signed {attribs {resolve_type immediate dependency {} format bool minimum {} maximum {}} value true}}}}}} \
] [get_bd_ports data_in]
create_bd_port -dir I -type clk clock_rtl
set_property -dict {CONFIG.FREQ_HZ 100000000 CONFIG.PHASE 0.000} [get_bd_ports clock_rtl]
create_bd_port -dir O -from 0 -to 0 buff_ready
create_bd_port -dir O -from 1 -to 0 LDPC_MODE
create_bd_port -dir O -from 15 -to 0 ERR_CODE
create_bd_port -dir O -from 7 -to 0 -type data Iteration_Number
create_bd_port -dir O deran_data_ap_vld
create_bd_port -dir O -from 7 -to 0 -type data deran_data
create_bd_port -dir O -from 15 -to 0 -type data cur_read_pos_V
create_bd_port -dir O -from 0 -to 0 -type data read_clk_en
create_bd_port -dir O -from 0 -to 0 DECODE_OUT
create_bd_port -dir O DECODE_OUT_VALID
create_bd_port -dir O -from 0 -to 0 -type data rd_clk_out
create_bd_port -dir I -from 0 -to 0 -type data rd_clk_in
set_property -dict [list \
  CONFIG.LAYERED_METADATA {xilinx.com:interface:datatypes:1.0 {DATA {datatype {name {attribs {resolve_type immediate dependency {} format string minimum {} maximum {}} value {}} bitwidth {attribs {resolve_type immediate dependency {} format long minimum {} maximum {}} value 1} bitoffset {attribs {resolve_type immediate dependency {} format long minimum {} maximum {}} value 0}}}}} \
] [get_bd_ports rd_clk_in]
create_bd_port -dir I -from 15 -to 0 -type data pMaxIterations
set_property -dict [list \
  CONFIG.LAYERED_METADATA {xilinx.com:interface:datatypes:1.0 {DATA {datatype {name {attribs {resolve_type immediate dependency {} format string minimum {} maximum {}} value {}} bitwidth {attribs {resolve_type immediate dependency {} format long minimum {} maximum {}} value 16} bitoffset {attribs {resolve_type immediate dependency {} format long minimum {} maximum {}} value 0} integer {signed {attribs {resolve_type immediate dependency {} format bool minimum {} maximum {}} value false}}}}}} \
] [get_bd_ports pMaxIterations]
create_bd_port -dir O -from 15 -to 0 -type data cur_write_pos_V
create_bd_port -dir O -from 0 -to 0 -type data full
create_bd_port -dir O -from 0 -to 0 -type data overrun
create_bd_port -dir O -from 7 -to 0 -type data Decoder_B_Iterations
create_bd_port -dir O -from 31 -to 0 -type data cnt_B

create_bd_cell -type ip -vlnv xilinx.com:ip:blk_mem_gen:8.3 raw_data_a
set_property -dict [list \
  CONFIG.Memory_Type True_Dual_Port_RAM \
  CONFIG.Enable_32bit_Address false \
  CONFIG.Use_Byte_Write_Enable false \
  CONFIG.Write_Width_A 8 \
  CONFIG.Read_Width_A 8 \
  CONFIG.Write_Width_B 8 \
  CONFIG.Read_Width_B 8 \
  CONFIG.Enable_B Use_ENB_Pin \
  CONFIG.Register_PortA_Output_of_Memory_Primitives false \
  CONFIG.Register_PortB_Output_of_Memory_Primitives false \
  CONFIG.Use_RSTA_Pin true \
  CONFIG.Port_B_Clock 100 \
  CONFIG.Port_B_Write_Rate 50 \
  CONFIG.Port_B_Enable_Rate 100 \
  CONFIG.use_bram_block Stand_Alone \
] [get_bd_cells raw_data_a]
create_bd_cell -type ip -vlnv xilinx.com:ip:blk_mem_gen:8.3 decode_data_a_0
set_property -dict [list \
  CONFIG.Memory_Type True_Dual_Port_RAM \
  CONFIG.Enable_32bit_Address false \
  CONFIG.Use_Byte_Write_Enable false \
  CONFIG.Write_Width_A 1 \
  CONFIG.Read_Width_A 1 \
  CONFIG.Write_Width_B 1 \
  CONFIG.Read_Width_B 1 \
  CONFIG.Enable_B Use_ENB_Pin \
  CONFIG.Register_PortA_Output_of_Memory_Primitives false \
  CONFIG.Register_PortB_Output_of_Memory_Primitives false \
  CONFIG.Use_RSTA_Pin false \
  CONFIG.Port_B_Clock 100 \
  CONFIG.Port_B_Write_Rate 50 \
  CONFIG.Port_B_Enable_Rate 100 \
  CONFIG.use_bram_block Stand_Alone \
] [get_bd_cells decode_data_a_0]
create_bd_cell -type ip -vlnv xilinx.com:ip:util_vector_logic:2.0 data_ce_mux1
set_property -dict {CONFIG.C_SIZE 1} [get_bd_cells data_ce_mux1]
create_bd_cell -type ip -vlnv xilinx.com:ip:util_vector_logic:2.0 CE_not
set_property -dict {CONFIG.C_SIZE 1 CONFIG.C_OPERATION not} [get_bd_cells CE_not]
create_bd_cell -type ip -vlnv xilinx.com:ip:util_vector_logic:2.0 raw_ce_mux_ba
set_property -dict {CONFIG.C_SIZE 1} [get_bd_cells raw_ce_mux_ba]
create_bd_cell -type ip -vlnv xilinx.com:ip:c_addsub:12.0 data_mux1
set_property -dict [list \
  CONFIG.A_Type Unsigned \
  CONFIG.B_Type Unsigned \
  CONFIG.A_Width 1 \
  CONFIG.B_Width 1 \
  CONFIG.Out_Width 1 \
  CONFIG.Latency 0 \
  CONFIG.B_Constant true \
  CONFIG.B_Value 0 \
  CONFIG.CE false \
  CONFIG.Bypass true \
] [get_bd_cells data_mux1]
create_bd_cell -type ip -vlnv xilinx.com:ip:blk_mem_gen:8.3 decode_data_b_0
set_property -dict [list \
  CONFIG.Memory_Type True_Dual_Port_RAM \
  CONFIG.Enable_32bit_Address false \
  CONFIG.Use_Byte_Write_Enable false \
  CONFIG.Write_Width_A 1 \
  CONFIG.Read_Width_A 1 \
  CONFIG.Write_Width_B 1 \
  CONFIG.Read_Width_B 1 \
  CONFIG.Enable_B Use_ENB_Pin \
  CONFIG.Register_PortA_Output_of_Memory_Primitives false \
  CONFIG.Register_PortB_Output_of_Memory_Primitives false \
  CONFIG.Use_RSTA_Pin false \
  CONFIG.Port_B_Clock 100 \
  CONFIG.Port_B_Write_Rate 50 \
  CONFIG.Port_B_Enable_Rate 100 \
  CONFIG.use_bram_block Stand_Alone \
] [get_bd_cells decode_data_b_0]
create_bd_cell -type ip -vlnv xilinx.com:ip:util_vector_logic:2.0 raw_ce_mux_aa
set_property -dict {CONFIG.C_SIZE 1} [get_bd_cells raw_ce_mux_aa]
create_bd_cell -type ip -vlnv xilinx.com:ip:blk_mem_gen:8.3 raw_data_b
set_property -dict [list \
  CONFIG.Memory_Type True_Dual_Port_RAM \
  CONFIG.Enable_32bit_Address false \
  CONFIG.Use_Byte_Write_Enable false \
  CONFIG.Write_Width_A 8 \
  CONFIG.Read_Width_A 8 \
  CONFIG.Write_Width_B 8 \
  CONFIG.Read_Width_B 8 \
  CONFIG.Enable_B Use_ENB_Pin \
  CONFIG.Register_PortA_Output_of_Memory_Primitives false \
  CONFIG.Register_PortB_Output_of_Memory_Primitives false \
  CONFIG.Use_RSTA_Pin true \
  CONFIG.Port_B_Clock 100 \
  CONFIG.Port_B_Write_Rate 50 \
  CONFIG.Port_B_Enable_Rate 100 \
  CONFIG.use_bram_block Stand_Alone \
] [get_bd_cells raw_data_b]
create_bd_cell -type ip -vlnv xilinx.com:ip:util_vector_logic:2.0 data_ce_mux
set_property -dict {CONFIG.C_SIZE 1} [get_bd_cells data_ce_mux]
create_bd_cell -type ip -vlnv xilinx.com:ip:util_vector_logic:2.0 util_vector_logic_0
set_property -dict {CONFIG.C_SIZE 1 CONFIG.C_OPERATION not} [get_bd_cells util_vector_logic_0]
create_bd_cell -type ip -vlnv xilinx.com:ip:xlconstant:1.1 LDPC_CTRL_ap_start
create_bd_cell -type ip -vlnv xilinx.com:ip:xlconstant:1.1 xlconstant_1
set_property -dict {CONFIG.CONST_VAL 0} [get_bd_cells xlconstant_1]
create_bd_cell -type ip -vlnv xilinx.com:ip:xlconstant:1.1 xlconstant_2
set_property -dict {CONFIG.CONST_VAL 0} [get_bd_cells xlconstant_2]
create_bd_cell -type ip -vlnv xilinx.com:ip:c_addsub:12.0 buff_start_lat
set_property -dict [list \
  CONFIG.A_Type Unsigned \
  CONFIG.B_Type Unsigned \
  CONFIG.A_Width 1 \
  CONFIG.B_Width 1 \
  CONFIG.Out_Width 1 \
  CONFIG.Latency 1 \
  CONFIG.B_Constant true \
  CONFIG.B_Value 0 \
] [get_bd_cells buff_start_lat]
create_bd_cell -type ip -vlnv xilinx.com:ip:c_addsub:12.0 status_lat
set_property -dict [list \
  CONFIG.A_Type Unsigned \
  CONFIG.B_Type Unsigned \
  CONFIG.A_Width 2 \
  CONFIG.B_Width 2 \
  CONFIG.Out_Width 2 \
  CONFIG.Latency 1 \
  CONFIG.B_Constant true \
  CONFIG.B_Value 00 \
] [get_bd_cells status_lat]
create_bd_cell -type ip -vlnv xilinx.com:ip:c_addsub:12.0 err_code_lat
set_property -dict [list \
  CONFIG.A_Type Unsigned \
  CONFIG.B_Type Unsigned \
  CONFIG.A_Width 16 \
  CONFIG.B_Width 16 \
  CONFIG.Out_Width 16 \
  CONFIG.Latency 1 \
  CONFIG.B_Constant true \
  CONFIG.B_Value 0000000000000000 \
] [get_bd_cells err_code_lat]
create_bd_cell -type ip -vlnv xilinx.com:ip:c_addsub:12.0 nR_M_lat
set_property -dict [list \
  CONFIG.A_Type Unsigned \
  CONFIG.B_Type Unsigned \
  CONFIG.A_Width 16 \
  CONFIG.B_Width 16 \
  CONFIG.Out_Width 16 \
  CONFIG.Latency 1 \
  CONFIG.B_Constant true \
  CONFIG.B_Value 0000000000000000 \
] [get_bd_cells nR_M_lat]
create_bd_cell -type ip -vlnv xilinx.com:ip:c_addsub:12.0 etaIndexM_M_lat
set_property -dict [list \
  CONFIG.A_Type Unsigned \
  CONFIG.B_Type Unsigned \
  CONFIG.A_Width 16 \
  CONFIG.B_Width 16 \
  CONFIG.Out_Width 16 \
  CONFIG.Latency 1 \
  CONFIG.B_Constant true \
  CONFIG.B_Value 0000000000000000 \
] [get_bd_cells etaIndexM_M_lat]
create_bd_cell -type ip -vlnv xilinx.com:ip:c_addsub:12.0 pCodeM_lat
set_property -dict [list \
  CONFIG.A_Type Unsigned \
  CONFIG.B_Type Unsigned \
  CONFIG.A_Width 16 \
  CONFIG.B_Width 16 \
  CONFIG.Out_Width 16 \
  CONFIG.Latency 1 \
  CONFIG.B_Constant true \
  CONFIG.B_Value 0000000000000000 \
] [get_bd_cells pCodeM_lat]
create_bd_cell -type ip -vlnv xilinx.com:ip:c_addsub:12.0 pMaxIterations_lat
set_property -dict [list \
  CONFIG.A_Type Unsigned \
  CONFIG.B_Type Unsigned \
  CONFIG.A_Width 16 \
  CONFIG.B_Width 16 \
  CONFIG.Out_Width 16 \
  CONFIG.Latency 1 \
  CONFIG.B_Constant true \
  CONFIG.B_Value 0000000000000000 \
] [get_bd_cells pMaxIterations_lat]
create_bd_cell -type ip -vlnv xilinx.com:ip:c_addsub:12.0 numbits_lat
set_property -dict [list \
  CONFIG.A_Type Unsigned \
  CONFIG.B_Type Unsigned \
  CONFIG.A_Width 16 \
  CONFIG.B_Width 16 \
  CONFIG.Out_Width 16 \
  CONFIG.Latency 1 \
  CONFIG.B_Constant true \
  CONFIG.B_Value 0000000000000000 \
] [get_bd_cells numbits_lat]
create_bd_cell -type ip -vlnv xilinx.com:ip:c_addsub:12.0 init_start_lat
set_property -dict [list \
  CONFIG.A_Type Unsigned \
  CONFIG.B_Type Unsigned \
  CONFIG.A_Width 1 \
  CONFIG.B_Width 1 \
  CONFIG.Out_Width 1 \
  CONFIG.Latency 1 \
  CONFIG.B_Constant true \
  CONFIG.B_Value 0 \
] [get_bd_cells init_start_lat]
create_bd_cell -type ip -vlnv xilinx.com:ip:c_addsub:12.0 size_lat
set_property -dict [list \
  CONFIG.A_Type Unsigned \
  CONFIG.B_Type Unsigned \
  CONFIG.A_Width 2 \
  CONFIG.B_Width 2 \
  CONFIG.Out_Width 2 \
  CONFIG.Latency 1 \
  CONFIG.B_Constant true \
  CONFIG.B_Value 00 \
] [get_bd_cells size_lat]
create_bd_cell -type ip -vlnv xilinx.com:ip:c_addsub:12.0 rate_lat
set_property -dict [list \
  CONFIG.A_Type Unsigned \
  CONFIG.B_Type Unsigned \
  CONFIG.A_Width 2 \
  CONFIG.B_Width 2 \
  CONFIG.Out_Width 2 \
  CONFIG.Latency 1 \
  CONFIG.B_Constant true \
  CONFIG.B_Value 00 \
] [get_bd_cells rate_lat]
create_bd_cell -type ip -vlnv xilinx.com:ip:c_addsub:12.0 itt_num_lat
set_property -dict [list \
  CONFIG.A_Type Unsigned \
  CONFIG.B_Type Unsigned \
  CONFIG.A_Width 8 \
  CONFIG.B_Width 8 \
  CONFIG.Out_Width 8 \
  CONFIG.Latency 1 \
  CONFIG.B_Constant true \
  CONFIG.B_Value 00000000 \
] [get_bd_cells itt_num_lat]
create_bd_cell -type ip -vlnv xilinx.com:hls:LDPC_CTRL:1.0 LDPC_CTRL_0
create_bd_cell -type ip -vlnv xilinx.com:ip:c_addsub:12.0 buff_rst_lat
set_property -dict [list \
  CONFIG.A_Type Unsigned \
  CONFIG.B_Type Unsigned \
  CONFIG.A_Width 1 \
  CONFIG.B_Width 1 \
  CONFIG.Out_Width 1 \
  CONFIG.Latency 1 \
  CONFIG.B_Constant true \
  CONFIG.B_Value 0 \
] [get_bd_cells buff_rst_lat]
create_bd_cell -type ip -vlnv xilinx.com:ip:c_addsub:12.0 decode_start_lat
set_property -dict [list \
  CONFIG.A_Type Unsigned \
  CONFIG.B_Type Unsigned \
  CONFIG.A_Width 1 \
  CONFIG.B_Width 1 \
  CONFIG.Out_Width 1 \
  CONFIG.Latency 1 \
  CONFIG.B_Constant true \
  CONFIG.B_Value 0 \
  CONFIG.SCLR true \
] [get_bd_cells decode_start_lat]
create_bd_cell -type ip -vlnv xilinx.com:ip:c_addsub:12.0 deran_lat
set_property -dict [list \
  CONFIG.A_Type Unsigned \
  CONFIG.B_Type Unsigned \
  CONFIG.A_Width 8 \
  CONFIG.B_Width 8 \
  CONFIG.Out_Width 8 \
  CONFIG.Latency 1 \
  CONFIG.B_Constant true \
  CONFIG.B_Value 00000000 \
] [get_bd_cells deran_lat]
create_bd_cell -type ip -vlnv xilinx.com:ip:c_addsub:12.0 out_mux_lat
set_property -dict [list \
  CONFIG.A_Type Unsigned \
  CONFIG.B_Type Unsigned \
  CONFIG.A_Width 1 \
  CONFIG.B_Width 1 \
  CONFIG.Out_Width 1 \
  CONFIG.Latency 1 \
  CONFIG.B_Constant true \
  CONFIG.B_Value 0 \
] [get_bd_cells out_mux_lat]
create_bd_cell -type ip -vlnv xilinx.com:ip:blk_mem_gen:8.3 raw_data_a1
set_property -dict [list \
  CONFIG.Memory_Type True_Dual_Port_RAM \
  CONFIG.Enable_32bit_Address false \
  CONFIG.Use_Byte_Write_Enable false \
  CONFIG.Write_Width_A 8 \
  CONFIG.Read_Width_A 8 \
  CONFIG.Write_Width_B 8 \
  CONFIG.Read_Width_B 8 \
  CONFIG.Enable_B Use_ENB_Pin \
  CONFIG.Register_PortA_Output_of_Memory_Primitives false \
  CONFIG.Register_PortB_Output_of_Memory_Primitives false \
  CONFIG.Use_RSTA_Pin false \
  CONFIG.Port_B_Clock 100 \
  CONFIG.Port_B_Write_Rate 50 \
  CONFIG.Port_B_Enable_Rate 100 \
  CONFIG.use_bram_block Stand_Alone \
] [get_bd_cells raw_data_a1]
create_bd_cell -type ip -vlnv xilinx.com:ip:blk_mem_gen:8.3 raw_data_b1
set_property -dict [list \
  CONFIG.Memory_Type True_Dual_Port_RAM \
  CONFIG.Enable_32bit_Address false \
  CONFIG.Use_Byte_Write_Enable false \
  CONFIG.Write_Width_A 8 \
  CONFIG.Read_Width_A 8 \
  CONFIG.Write_Width_B 8 \
  CONFIG.Read_Width_B 8 \
  CONFIG.Enable_B Use_ENB_Pin \
  CONFIG.Register_PortA_Output_of_Memory_Primitives false \
  CONFIG.Register_PortB_Output_of_Memory_Primitives false \
  CONFIG.Use_RSTA_Pin false \
  CONFIG.Port_B_Clock 100 \
  CONFIG.Port_B_Write_Rate 50 \
  CONFIG.Port_B_Enable_Rate 100 \
  CONFIG.use_bram_block Stand_Alone \
] [get_bd_cells raw_data_b1]
create_bd_cell -type ip -vlnv xilinx.com:ip:util_vector_logic:2.0 raw_ce_mux_aa1
set_property -dict {CONFIG.C_SIZE 1} [get_bd_cells raw_ce_mux_aa1]
create_bd_cell -type ip -vlnv xilinx.com:ip:util_vector_logic:2.0 raw_ce_mux_ba1
set_property -dict {CONFIG.C_SIZE 1} [get_bd_cells raw_ce_mux_ba1]
create_bd_cell -type ip -vlnv xilinx.com:ip:blk_mem_gen:8.3 raw_data_a2
set_property -dict [list \
  CONFIG.Memory_Type True_Dual_Port_RAM \
  CONFIG.Enable_32bit_Address false \
  CONFIG.Use_Byte_Write_Enable false \
  CONFIG.Write_Width_A 8 \
  CONFIG.Read_Width_A 8 \
  CONFIG.Write_Width_B 8 \
  CONFIG.Read_Width_B 8 \
  CONFIG.Enable_B Use_ENB_Pin \
  CONFIG.Register_PortA_Output_of_Memory_Primitives false \
  CONFIG.Register_PortB_Output_of_Memory_Primitives false \
  CONFIG.Use_RSTA_Pin false \
  CONFIG.Port_B_Clock 100 \
  CONFIG.Port_B_Write_Rate 50 \
  CONFIG.Port_B_Enable_Rate 100 \
  CONFIG.use_bram_block Stand_Alone \
] [get_bd_cells raw_data_a2]
create_bd_cell -type ip -vlnv xilinx.com:ip:blk_mem_gen:8.3 raw_data_b2
set_property -dict [list \
  CONFIG.Memory_Type True_Dual_Port_RAM \
  CONFIG.Enable_32bit_Address false \
  CONFIG.Use_Byte_Write_Enable false \
  CONFIG.Write_Width_A 8 \
  CONFIG.Read_Width_A 8 \
  CONFIG.Write_Width_B 8 \
  CONFIG.Read_Width_B 8 \
  CONFIG.Enable_B Use_ENB_Pin \
  CONFIG.Register_PortA_Output_of_Memory_Primitives false \
  CONFIG.Register_PortB_Output_of_Memory_Primitives false \
  CONFIG.Use_RSTA_Pin false \
  CONFIG.Port_B_Clock 100 \
  CONFIG.Port_B_Write_Rate 50 \
  CONFIG.Port_B_Enable_Rate 100 \
  CONFIG.use_bram_block Stand_Alone \
] [get_bd_cells raw_data_b2]
create_bd_cell -type ip -vlnv xilinx.com:ip:util_vector_logic:2.0 raw_ce_mux_aa2
set_property -dict {CONFIG.C_SIZE 1} [get_bd_cells raw_ce_mux_aa2]
create_bd_cell -type ip -vlnv xilinx.com:ip:util_vector_logic:2.0 raw_ce_mux_ba2
set_property -dict {CONFIG.C_SIZE 1} [get_bd_cells raw_ce_mux_ba2]
create_bd_cell -type ip -vlnv xilinx.com:ip:blk_mem_gen:8.3 raw_data_a3
set_property -dict [list \
  CONFIG.Memory_Type True_Dual_Port_RAM \
  CONFIG.Enable_32bit_Address false \
  CONFIG.Use_Byte_Write_Enable false \
  CONFIG.Write_Width_A 8 \
  CONFIG.Read_Width_A 8 \
  CONFIG.Write_Width_B 8 \
  CONFIG.Read_Width_B 8 \
  CONFIG.Enable_B Use_ENB_Pin \
  CONFIG.Register_PortA_Output_of_Memory_Primitives false \
  CONFIG.Register_PortB_Output_of_Memory_Primitives false \
  CONFIG.Use_RSTA_Pin false \
  CONFIG.Port_B_Clock 100 \
  CONFIG.Port_B_Write_Rate 50 \
  CONFIG.Port_B_Enable_Rate 100 \
  CONFIG.use_bram_block Stand_Alone \
] [get_bd_cells raw_data_a3]
create_bd_cell -type ip -vlnv xilinx.com:ip:blk_mem_gen:8.3 raw_data_b3
set_property -dict [list \
  CONFIG.Memory_Type True_Dual_Port_RAM \
  CONFIG.Enable_32bit_Address false \
  CONFIG.Use_Byte_Write_Enable false \
  CONFIG.Write_Width_A 8 \
  CONFIG.Read_Width_A 8 \
  CONFIG.Write_Width_B 8 \
  CONFIG.Read_Width_B 8 \
  CONFIG.Enable_B Use_ENB_Pin \
  CONFIG.Register_PortA_Output_of_Memory_Primitives false \
  CONFIG.Register_PortB_Output_of_Memory_Primitives false \
  CONFIG.Use_RSTA_Pin false \
  CONFIG.Port_B_Clock 100 \
  CONFIG.Port_B_Write_Rate 50 \
  CONFIG.Port_B_Enable_Rate 100 \
  CONFIG.use_bram_block Stand_Alone \
] [get_bd_cells raw_data_b3]
create_bd_cell -type ip -vlnv xilinx.com:ip:util_vector_logic:2.0 raw_ce_mux_aa3
set_property -dict {CONFIG.C_SIZE 1} [get_bd_cells raw_ce_mux_aa3]
create_bd_cell -type ip -vlnv xilinx.com:ip:util_vector_logic:2.0 raw_ce_mux_ba3
set_property -dict {CONFIG.C_SIZE 1} [get_bd_cells raw_ce_mux_ba3]
create_bd_cell -type ip -vlnv xilinx.com:ip:blk_mem_gen:8.3 raw_data_a4
set_property -dict [list \
  CONFIG.Memory_Type True_Dual_Port_RAM \
  CONFIG.Enable_32bit_Address false \
  CONFIG.Use_Byte_Write_Enable false \
  CONFIG.Write_Width_A 8 \
  CONFIG.Read_Width_A 8 \
  CONFIG.Write_Width_B 8 \
  CONFIG.Read_Width_B 8 \
  CONFIG.Enable_B Use_ENB_Pin \
  CONFIG.Register_PortA_Output_of_Memory_Primitives false \
  CONFIG.Register_PortB_Output_of_Memory_Primitives false \
  CONFIG.Use_RSTA_Pin false \
  CONFIG.Port_B_Clock 100 \
  CONFIG.Port_B_Write_Rate 50 \
  CONFIG.Port_B_Enable_Rate 100 \
  CONFIG.use_bram_block Stand_Alone \
] [get_bd_cells raw_data_a4]
create_bd_cell -type ip -vlnv xilinx.com:ip:blk_mem_gen:8.3 raw_data_b4
set_property -dict [list \
  CONFIG.Memory_Type True_Dual_Port_RAM \
  CONFIG.Enable_32bit_Address false \
  CONFIG.Use_Byte_Write_Enable false \
  CONFIG.Write_Width_A 8 \
  CONFIG.Read_Width_A 8 \
  CONFIG.Write_Width_B 8 \
  CONFIG.Read_Width_B 8 \
  CONFIG.Enable_B Use_ENB_Pin \
  CONFIG.Register_PortA_Output_of_Memory_Primitives false \
  CONFIG.Register_PortB_Output_of_Memory_Primitives false \
  CONFIG.Use_RSTA_Pin false \
  CONFIG.Port_B_Clock 100 \
  CONFIG.Port_B_Write_Rate 50 \
  CONFIG.Port_B_Enable_Rate 100 \
  CONFIG.use_bram_block Stand_Alone \
] [get_bd_cells raw_data_b4]
create_bd_cell -type ip -vlnv xilinx.com:ip:util_vector_logic:2.0 raw_ce_mux_aa4
set_property -dict {CONFIG.C_SIZE 1} [get_bd_cells raw_ce_mux_aa4]
create_bd_cell -type ip -vlnv xilinx.com:ip:util_vector_logic:2.0 raw_ce_mux_ba4
set_property -dict {CONFIG.C_SIZE 1} [get_bd_cells raw_ce_mux_ba4]
create_bd_cell -type ip -vlnv xilinx.com:ip:blk_mem_gen:8.3 raw_data_a5
set_property -dict [list \
  CONFIG.Memory_Type True_Dual_Port_RAM \
  CONFIG.Enable_32bit_Address false \
  CONFIG.Use_Byte_Write_Enable false \
  CONFIG.Write_Width_A 8 \
  CONFIG.Read_Width_A 8 \
  CONFIG.Write_Width_B 8 \
  CONFIG.Read_Width_B 8 \
  CONFIG.Enable_B Use_ENB_Pin \
  CONFIG.Register_PortA_Output_of_Memory_Primitives false \
  CONFIG.Register_PortB_Output_of_Memory_Primitives false \
  CONFIG.Use_RSTA_Pin false \
  CONFIG.Port_B_Clock 100 \
  CONFIG.Port_B_Write_Rate 50 \
  CONFIG.Port_B_Enable_Rate 100 \
  CONFIG.use_bram_block Stand_Alone \
] [get_bd_cells raw_data_a5]
create_bd_cell -type ip -vlnv xilinx.com:ip:blk_mem_gen:8.3 raw_data_b5
set_property -dict [list \
  CONFIG.Memory_Type True_Dual_Port_RAM \
  CONFIG.Enable_32bit_Address false \
  CONFIG.Use_Byte_Write_Enable false \
  CONFIG.Write_Width_A 8 \
  CONFIG.Read_Width_A 8 \
  CONFIG.Write_Width_B 8 \
  CONFIG.Read_Width_B 8 \
  CONFIG.Enable_B Use_ENB_Pin \
  CONFIG.Register_PortA_Output_of_Memory_Primitives false \
  CONFIG.Register_PortB_Output_of_Memory_Primitives false \
  CONFIG.Use_RSTA_Pin false \
  CONFIG.Port_B_Clock 100 \
  CONFIG.Port_B_Write_Rate 50 \
  CONFIG.Port_B_Enable_Rate 100 \
  CONFIG.use_bram_block Stand_Alone \
] [get_bd_cells raw_data_b5]
create_bd_cell -type ip -vlnv xilinx.com:ip:util_vector_logic:2.0 raw_ce_mux_aa5
set_property -dict {CONFIG.C_SIZE 1} [get_bd_cells raw_ce_mux_aa5]
create_bd_cell -type ip -vlnv xilinx.com:ip:util_vector_logic:2.0 raw_ce_mux_ba5
set_property -dict {CONFIG.C_SIZE 1} [get_bd_cells raw_ce_mux_ba5]
create_bd_cell -type ip -vlnv xilinx.com:ip:blk_mem_gen:8.3 raw_data_a6
set_property -dict [list \
  CONFIG.Memory_Type True_Dual_Port_RAM \
  CONFIG.Enable_32bit_Address false \
  CONFIG.Use_Byte_Write_Enable false \
  CONFIG.Write_Width_A 8 \
  CONFIG.Read_Width_A 8 \
  CONFIG.Write_Width_B 8 \
  CONFIG.Read_Width_B 8 \
  CONFIG.Enable_B Use_ENB_Pin \
  CONFIG.Register_PortA_Output_of_Memory_Primitives false \
  CONFIG.Register_PortB_Output_of_Memory_Primitives false \
  CONFIG.Use_RSTA_Pin false \
  CONFIG.Port_B_Clock 100 \
  CONFIG.Port_B_Write_Rate 50 \
  CONFIG.Port_B_Enable_Rate 100 \
  CONFIG.use_bram_block Stand_Alone \
] [get_bd_cells raw_data_a6]
create_bd_cell -type ip -vlnv xilinx.com:ip:blk_mem_gen:8.3 raw_data_b6
set_property -dict [list \
  CONFIG.Memory_Type True_Dual_Port_RAM \
  CONFIG.Enable_32bit_Address false \
  CONFIG.Use_Byte_Write_Enable false \
  CONFIG.Write_Width_A 8 \
  CONFIG.Read_Width_A 8 \
  CONFIG.Write_Width_B 8 \
  CONFIG.Read_Width_B 8 \
  CONFIG.Enable_B Use_ENB_Pin \
  CONFIG.Register_PortA_Output_of_Memory_Primitives false \
  CONFIG.Register_PortB_Output_of_Memory_Primitives false \
  CONFIG.Use_RSTA_Pin false \
  CONFIG.Port_B_Clock 100 \
  CONFIG.Port_B_Write_Rate 50 \
  CONFIG.Port_B_Enable_Rate 100 \
  CONFIG.use_bram_block Stand_Alone \
] [get_bd_cells raw_data_b6]
create_bd_cell -type ip -vlnv xilinx.com:ip:util_vector_logic:2.0 raw_ce_mux_aa6
set_property -dict {CONFIG.C_SIZE 1} [get_bd_cells raw_ce_mux_aa6]
create_bd_cell -type ip -vlnv xilinx.com:ip:util_vector_logic:2.0 raw_ce_mux_ba6
set_property -dict {CONFIG.C_SIZE 1} [get_bd_cells raw_ce_mux_ba6]
create_bd_cell -type ip -vlnv xilinx.com:ip:blk_mem_gen:8.3 raw_data_a7
set_property -dict [list \
  CONFIG.Memory_Type True_Dual_Port_RAM \
  CONFIG.Enable_32bit_Address false \
  CONFIG.Use_Byte_Write_Enable false \
  CONFIG.Write_Width_A 8 \
  CONFIG.Read_Width_A 8 \
  CONFIG.Write_Width_B 8 \
  CONFIG.Read_Width_B 8 \
  CONFIG.Enable_B Use_ENB_Pin \
  CONFIG.Register_PortA_Output_of_Memory_Primitives false \
  CONFIG.Register_PortB_Output_of_Memory_Primitives false \
  CONFIG.Use_RSTA_Pin false \
  CONFIG.Port_B_Clock 100 \
  CONFIG.Port_B_Write_Rate 50 \
  CONFIG.Port_B_Enable_Rate 100 \
  CONFIG.use_bram_block Stand_Alone \
] [get_bd_cells raw_data_a7]
create_bd_cell -type ip -vlnv xilinx.com:ip:blk_mem_gen:8.3 raw_data_b7
set_property -dict [list \
  CONFIG.Memory_Type True_Dual_Port_RAM \
  CONFIG.Enable_32bit_Address false \
  CONFIG.Use_Byte_Write_Enable false \
  CONFIG.Write_Width_A 8 \
  CONFIG.Read_Width_A 8 \
  CONFIG.Write_Width_B 8 \
  CONFIG.Read_Width_B 8 \
  CONFIG.Enable_B Use_ENB_Pin \
  CONFIG.Register_PortA_Output_of_Memory_Primitives false \
  CONFIG.Register_PortB_Output_of_Memory_Primitives false \
  CONFIG.Use_RSTA_Pin false \
  CONFIG.Port_B_Clock 100 \
  CONFIG.Port_B_Write_Rate 50 \
  CONFIG.Port_B_Enable_Rate 100 \
  CONFIG.use_bram_block Stand_Alone \
] [get_bd_cells raw_data_b7]
create_bd_cell -type ip -vlnv xilinx.com:ip:util_vector_logic:2.0 raw_ce_mux_aa7
set_property -dict {CONFIG.C_SIZE 1} [get_bd_cells raw_ce_mux_aa7]
create_bd_cell -type ip -vlnv xilinx.com:ip:util_vector_logic:2.0 raw_ce_mux_ba7
set_property -dict {CONFIG.C_SIZE 1} [get_bd_cells raw_ce_mux_ba7]
create_bd_cell -type ip -vlnv xilinx.com:ip:blk_mem_gen:8.3 raw_data_a8
set_property -dict [list \
  CONFIG.Memory_Type True_Dual_Port_RAM \
  CONFIG.Enable_32bit_Address false \
  CONFIG.Use_Byte_Write_Enable false \
  CONFIG.Write_Width_A 8 \
  CONFIG.Read_Width_A 8 \
  CONFIG.Write_Width_B 8 \
  CONFIG.Read_Width_B 8 \
  CONFIG.Enable_B Use_ENB_Pin \
  CONFIG.Register_PortA_Output_of_Memory_Primitives false \
  CONFIG.Register_PortB_Output_of_Memory_Primitives false \
  CONFIG.Use_RSTA_Pin false \
  CONFIG.Port_B_Clock 100 \
  CONFIG.Port_B_Write_Rate 50 \
  CONFIG.Port_B_Enable_Rate 100 \
  CONFIG.use_bram_block Stand_Alone \
] [get_bd_cells raw_data_a8]
create_bd_cell -type ip -vlnv xilinx.com:ip:blk_mem_gen:8.3 raw_data_b8
set_property -dict [list \
  CONFIG.Memory_Type True_Dual_Port_RAM \
  CONFIG.Enable_32bit_Address false \
  CONFIG.Use_Byte_Write_Enable false \
  CONFIG.Write_Width_A 8 \
  CONFIG.Read_Width_A 8 \
  CONFIG.Write_Width_B 8 \
  CONFIG.Read_Width_B 8 \
  CONFIG.Enable_B Use_ENB_Pin \
  CONFIG.Register_PortA_Output_of_Memory_Primitives false \
  CONFIG.Register_PortB_Output_of_Memory_Primitives false \
  CONFIG.Use_RSTA_Pin false \
  CONFIG.Port_B_Clock 100 \
  CONFIG.Port_B_Write_Rate 50 \
  CONFIG.Port_B_Enable_Rate 100 \
  CONFIG.use_bram_block Stand_Alone \
] [get_bd_cells raw_data_b8]
create_bd_cell -type ip -vlnv xilinx.com:ip:util_vector_logic:2.0 raw_ce_mux_aa8
set_property -dict {CONFIG.C_SIZE 1} [get_bd_cells raw_ce_mux_aa8]
create_bd_cell -type ip -vlnv xilinx.com:ip:util_vector_logic:2.0 raw_ce_mux_ba8
set_property -dict {CONFIG.C_SIZE 1} [get_bd_cells raw_ce_mux_ba8]
create_bd_cell -type ip -vlnv xilinx.com:ip:blk_mem_gen:8.3 raw_data_a9
set_property -dict [list \
  CONFIG.Memory_Type True_Dual_Port_RAM \
  CONFIG.Enable_32bit_Address false \
  CONFIG.Use_Byte_Write_Enable false \
  CONFIG.Write_Width_A 8 \
  CONFIG.Read_Width_A 8 \
  CONFIG.Write_Width_B 8 \
  CONFIG.Read_Width_B 8 \
  CONFIG.Enable_B Use_ENB_Pin \
  CONFIG.Register_PortA_Output_of_Memory_Primitives false \
  CONFIG.Register_PortB_Output_of_Memory_Primitives false \
  CONFIG.Use_RSTA_Pin false \
  CONFIG.Port_B_Clock 100 \
  CONFIG.Port_B_Write_Rate 50 \
  CONFIG.Port_B_Enable_Rate 100 \
  CONFIG.use_bram_block Stand_Alone \
] [get_bd_cells raw_data_a9]
create_bd_cell -type ip -vlnv xilinx.com:ip:blk_mem_gen:8.3 raw_data_b9
set_property -dict [list \
  CONFIG.Memory_Type True_Dual_Port_RAM \
  CONFIG.Enable_32bit_Address false \
  CONFIG.Use_Byte_Write_Enable false \
  CONFIG.Write_Width_A 8 \
  CONFIG.Read_Width_A 8 \
  CONFIG.Write_Width_B 8 \
  CONFIG.Read_Width_B 8 \
  CONFIG.Enable_B Use_ENB_Pin \
  CONFIG.Register_PortA_Output_of_Memory_Primitives false \
  CONFIG.Register_PortB_Output_of_Memory_Primitives false \
  CONFIG.Use_RSTA_Pin false \
  CONFIG.Port_B_Clock 100 \
  CONFIG.Port_B_Write_Rate 50 \
  CONFIG.Port_B_Enable_Rate 100 \
  CONFIG.use_bram_block Stand_Alone \
] [get_bd_cells raw_data_b9]
create_bd_cell -type ip -vlnv xilinx.com:ip:util_vector_logic:2.0 raw_ce_mux_aa9
set_property -dict {CONFIG.C_SIZE 1} [get_bd_cells raw_ce_mux_aa9]
create_bd_cell -type ip -vlnv xilinx.com:ip:util_vector_logic:2.0 raw_ce_mux_ba9
set_property -dict {CONFIG.C_SIZE 1} [get_bd_cells raw_ce_mux_ba9]
create_bd_cell -type ip -vlnv xilinx.com:ip:xlconstant:1.1 xlconstant_0
set_property -dict {CONFIG.CONST_WIDTH 8 CONFIG.CONST_VAL 0} [get_bd_cells xlconstant_0]
create_bd_cell -type ip -vlnv xilinx.com:hls:setupLDPC:1.0 setupLDPC_0
create_bd_cell -type ip -vlnv xilinx.com:hls:LDPC_Div:1.0 LDPC_Div_0
create_bd_cell -type ip -vlnv xilinx.com:ip:blk_mem_gen:8.3 decode_data_b_1
set_property -dict [list \
  CONFIG.Memory_Type True_Dual_Port_RAM \
  CONFIG.Enable_32bit_Address false \
  CONFIG.Use_Byte_Write_Enable false \
  CONFIG.Write_Width_A 1 \
  CONFIG.Read_Width_A 1 \
  CONFIG.Write_Width_B 1 \
  CONFIG.Read_Width_B 1 \
  CONFIG.Enable_B Use_ENB_Pin \
  CONFIG.Register_PortA_Output_of_Memory_Primitives false \
  CONFIG.Register_PortB_Output_of_Memory_Primitives false \
  CONFIG.Use_RSTA_Pin false \
  CONFIG.Port_B_Clock 100 \
  CONFIG.Port_B_Write_Rate 50 \
  CONFIG.Port_B_Enable_Rate 100 \
  CONFIG.use_bram_block Stand_Alone \
] [get_bd_cells decode_data_b_1]
create_bd_cell -type ip -vlnv xilinx.com:ip:blk_mem_gen:8.3 decode_data_a_1
set_property -dict [list \
  CONFIG.Memory_Type True_Dual_Port_RAM \
  CONFIG.Enable_32bit_Address false \
  CONFIG.Use_Byte_Write_Enable false \
  CONFIG.Write_Width_A 1 \
  CONFIG.Read_Width_A 1 \
  CONFIG.Write_Width_B 1 \
  CONFIG.Read_Width_B 1 \
  CONFIG.Enable_B Use_ENB_Pin \
  CONFIG.Register_PortA_Output_of_Memory_Primitives false \
  CONFIG.Register_PortB_Output_of_Memory_Primitives false \
  CONFIG.Use_RSTA_Pin false \
  CONFIG.Port_B_Clock 100 \
  CONFIG.Port_B_Write_Rate 50 \
  CONFIG.Port_B_Enable_Rate 100 \
  CONFIG.use_bram_block Stand_Alone \
] [get_bd_cells decode_data_a_1]
create_bd_cell -type ip -vlnv xilinx.com:ip:util_vector_logic:2.0 data_ce_mux_bb_1
set_property -dict {CONFIG.C_SIZE 1} [get_bd_cells data_ce_mux_bb_1]
create_bd_cell -type ip -vlnv xilinx.com:ip:util_vector_logic:2.0 data_ce_mux_ab_1
set_property -dict {CONFIG.C_SIZE 1} [get_bd_cells data_ce_mux_ab_1]
create_bd_cell -type ip -vlnv xilinx.com:ip:c_addsub:12.0 data_mux11
set_property -dict [list \
  CONFIG.A_Type Unsigned \
  CONFIG.B_Type Unsigned \
  CONFIG.A_Width 1 \
  CONFIG.B_Width 1 \
  CONFIG.Out_Width 1 \
  CONFIG.Latency 0 \
  CONFIG.B_Constant true \
  CONFIG.B_Value 0 \
  CONFIG.CE false \
  CONFIG.Bypass true \
] [get_bd_cells data_mux11]
create_bd_cell -type ip -vlnv xilinx.com:ip:blk_mem_gen:8.3 decode_data_b_2
set_property -dict [list \
  CONFIG.Memory_Type True_Dual_Port_RAM \
  CONFIG.Enable_32bit_Address false \
  CONFIG.Use_Byte_Write_Enable false \
  CONFIG.Write_Width_A 1 \
  CONFIG.Read_Width_A 1 \
  CONFIG.Write_Width_B 1 \
  CONFIG.Read_Width_B 1 \
  CONFIG.Enable_B Use_ENB_Pin \
  CONFIG.Register_PortA_Output_of_Memory_Primitives false \
  CONFIG.Register_PortB_Output_of_Memory_Primitives false \
  CONFIG.Use_RSTA_Pin false \
  CONFIG.Port_B_Clock 100 \
  CONFIG.Port_B_Write_Rate 50 \
  CONFIG.Port_B_Enable_Rate 100 \
  CONFIG.use_bram_block Stand_Alone \
] [get_bd_cells decode_data_b_2]
create_bd_cell -type ip -vlnv xilinx.com:ip:blk_mem_gen:8.3 decode_data_a_2
set_property -dict [list \
  CONFIG.Memory_Type True_Dual_Port_RAM \
  CONFIG.Enable_32bit_Address false \
  CONFIG.Use_Byte_Write_Enable false \
  CONFIG.Write_Width_A 1 \
  CONFIG.Read_Width_A 1 \
  CONFIG.Write_Width_B 1 \
  CONFIG.Read_Width_B 1 \
  CONFIG.Enable_B Use_ENB_Pin \
  CONFIG.Register_PortA_Output_of_Memory_Primitives false \
  CONFIG.Register_PortB_Output_of_Memory_Primitives false \
  CONFIG.Use_RSTA_Pin false \
  CONFIG.Port_B_Clock 100 \
  CONFIG.Port_B_Write_Rate 50 \
  CONFIG.Port_B_Enable_Rate 100 \
  CONFIG.use_bram_block Stand_Alone \
] [get_bd_cells decode_data_a_2]
create_bd_cell -type ip -vlnv xilinx.com:ip:util_vector_logic:2.0 data_ce_mux_bb_2
set_property -dict {CONFIG.C_SIZE 1} [get_bd_cells data_ce_mux_bb_2]
create_bd_cell -type ip -vlnv xilinx.com:ip:util_vector_logic:2.0 data_ce_mux_ab_2
set_property -dict {CONFIG.C_SIZE 1} [get_bd_cells data_ce_mux_ab_2]
create_bd_cell -type ip -vlnv xilinx.com:ip:c_addsub:12.0 data_mux12
set_property -dict [list \
  CONFIG.A_Type Unsigned \
  CONFIG.B_Type Unsigned \
  CONFIG.A_Width 1 \
  CONFIG.B_Width 1 \
  CONFIG.Out_Width 1 \
  CONFIG.Latency 0 \
  CONFIG.B_Constant true \
  CONFIG.B_Value 0 \
  CONFIG.CE false \
  CONFIG.Bypass true \
] [get_bd_cells data_mux12]
create_bd_cell -type ip -vlnv xilinx.com:ip:blk_mem_gen:8.3 decode_data_b_3
set_property -dict [list \
  CONFIG.Memory_Type True_Dual_Port_RAM \
  CONFIG.Enable_32bit_Address false \
  CONFIG.Use_Byte_Write_Enable false \
  CONFIG.Write_Width_A 1 \
  CONFIG.Read_Width_A 1 \
  CONFIG.Write_Width_B 1 \
  CONFIG.Read_Width_B 1 \
  CONFIG.Enable_B Use_ENB_Pin \
  CONFIG.Register_PortA_Output_of_Memory_Primitives false \
  CONFIG.Register_PortB_Output_of_Memory_Primitives false \
  CONFIG.Use_RSTA_Pin false \
  CONFIG.Port_B_Clock 100 \
  CONFIG.Port_B_Write_Rate 50 \
  CONFIG.Port_B_Enable_Rate 100 \
  CONFIG.use_bram_block Stand_Alone \
] [get_bd_cells decode_data_b_3]
create_bd_cell -type ip -vlnv xilinx.com:ip:blk_mem_gen:8.3 decode_data_a_3
set_property -dict [list \
  CONFIG.Memory_Type True_Dual_Port_RAM \
  CONFIG.Enable_32bit_Address false \
  CONFIG.Use_Byte_Write_Enable false \
  CONFIG.Write_Width_A 1 \
  CONFIG.Read_Width_A 1 \
  CONFIG.Write_Width_B 1 \
  CONFIG.Read_Width_B 1 \
  CONFIG.Enable_B Use_ENB_Pin \
  CONFIG.Register_PortA_Output_of_Memory_Primitives false \
  CONFIG.Register_PortB_Output_of_Memory_Primitives false \
  CONFIG.Use_RSTA_Pin false \
  CONFIG.Port_B_Clock 100 \
  CONFIG.Port_B_Write_Rate 50 \
  CONFIG.Port_B_Enable_Rate 100 \
  CONFIG.use_bram_block Stand_Alone \
] [get_bd_cells decode_data_a_3]
create_bd_cell -type ip -vlnv xilinx.com:ip:util_vector_logic:2.0 data_ce_mux_bb_3
set_property -dict {CONFIG.C_SIZE 1} [get_bd_cells data_ce_mux_bb_3]
create_bd_cell -type ip -vlnv xilinx.com:ip:util_vector_logic:2.0 data_ce_mux_ab_3
set_property -dict {CONFIG.C_SIZE 1} [get_bd_cells data_ce_mux_ab_3]
create_bd_cell -type ip -vlnv xilinx.com:ip:c_addsub:12.0 data_mux13
set_property -dict [list \
  CONFIG.A_Type Unsigned \
  CONFIG.B_Type Unsigned \
  CONFIG.A_Width 1 \
  CONFIG.B_Width 1 \
  CONFIG.Out_Width 1 \
  CONFIG.Latency 0 \
  CONFIG.B_Constant true \
  CONFIG.B_Value 0 \
  CONFIG.CE false \
  CONFIG.Bypass true \
] [get_bd_cells data_mux13]
create_bd_cell -type ip -vlnv xilinx.com:ip:blk_mem_gen:8.3 decode_data_b_4
set_property -dict [list \
  CONFIG.Memory_Type True_Dual_Port_RAM \
  CONFIG.Enable_32bit_Address false \
  CONFIG.Use_Byte_Write_Enable false \
  CONFIG.Write_Width_A 1 \
  CONFIG.Read_Width_A 1 \
  CONFIG.Write_Width_B 1 \
  CONFIG.Read_Width_B 1 \
  CONFIG.Enable_B Use_ENB_Pin \
  CONFIG.Register_PortA_Output_of_Memory_Primitives false \
  CONFIG.Register_PortB_Output_of_Memory_Primitives false \
  CONFIG.Use_RSTA_Pin false \
  CONFIG.Port_B_Clock 100 \
  CONFIG.Port_B_Write_Rate 50 \
  CONFIG.Port_B_Enable_Rate 100 \
  CONFIG.use_bram_block Stand_Alone \
] [get_bd_cells decode_data_b_4]
create_bd_cell -type ip -vlnv xilinx.com:ip:blk_mem_gen:8.3 decode_data_a_4
set_property -dict [list \
  CONFIG.Memory_Type True_Dual_Port_RAM \
  CONFIG.Enable_32bit_Address false \
  CONFIG.Use_Byte_Write_Enable false \
  CONFIG.Write_Width_A 1 \
  CONFIG.Read_Width_A 1 \
  CONFIG.Write_Width_B 1 \
  CONFIG.Read_Width_B 1 \
  CONFIG.Enable_B Use_ENB_Pin \
  CONFIG.Register_PortA_Output_of_Memory_Primitives false \
  CONFIG.Register_PortB_Output_of_Memory_Primitives false \
  CONFIG.Use_RSTA_Pin false \
  CONFIG.Port_B_Clock 100 \
  CONFIG.Port_B_Write_Rate 50 \
  CONFIG.Port_B_Enable_Rate 100 \
  CONFIG.use_bram_block Stand_Alone \
] [get_bd_cells decode_data_a_4]
create_bd_cell -type ip -vlnv xilinx.com:ip:util_vector_logic:2.0 data_ce_mux_bb_4
set_property -dict {CONFIG.C_SIZE 1} [get_bd_cells data_ce_mux_bb_4]
create_bd_cell -type ip -vlnv xilinx.com:ip:util_vector_logic:2.0 data_ce_mux_ab_4
set_property -dict {CONFIG.C_SIZE 1} [get_bd_cells data_ce_mux_ab_4]
create_bd_cell -type ip -vlnv xilinx.com:ip:c_addsub:12.0 data_mux14
set_property -dict [list \
  CONFIG.A_Type Unsigned \
  CONFIG.B_Type Unsigned \
  CONFIG.A_Width 1 \
  CONFIG.B_Width 1 \
  CONFIG.Out_Width 1 \
  CONFIG.Latency 0 \
  CONFIG.B_Constant true \
  CONFIG.B_Value 0 \
  CONFIG.CE false \
  CONFIG.Bypass true \
] [get_bd_cells data_mux14]
create_bd_cell -type ip -vlnv xilinx.com:ip:blk_mem_gen:8.3 decode_data_b_5
set_property -dict [list \
  CONFIG.Memory_Type True_Dual_Port_RAM \
  CONFIG.Enable_32bit_Address false \
  CONFIG.Use_Byte_Write_Enable false \
  CONFIG.Write_Width_A 1 \
  CONFIG.Read_Width_A 1 \
  CONFIG.Write_Width_B 1 \
  CONFIG.Read_Width_B 1 \
  CONFIG.Enable_B Use_ENB_Pin \
  CONFIG.Register_PortA_Output_of_Memory_Primitives false \
  CONFIG.Register_PortB_Output_of_Memory_Primitives false \
  CONFIG.Use_RSTA_Pin false \
  CONFIG.Port_B_Clock 100 \
  CONFIG.Port_B_Write_Rate 50 \
  CONFIG.Port_B_Enable_Rate 100 \
  CONFIG.use_bram_block Stand_Alone \
] [get_bd_cells decode_data_b_5]
create_bd_cell -type ip -vlnv xilinx.com:ip:blk_mem_gen:8.3 decode_data_a_5
set_property -dict [list \
  CONFIG.Memory_Type True_Dual_Port_RAM \
  CONFIG.Enable_32bit_Address false \
  CONFIG.Use_Byte_Write_Enable false \
  CONFIG.Write_Width_A 1 \
  CONFIG.Read_Width_A 1 \
  CONFIG.Write_Width_B 1 \
  CONFIG.Read_Width_B 1 \
  CONFIG.Enable_B Use_ENB_Pin \
  CONFIG.Register_PortA_Output_of_Memory_Primitives false \
  CONFIG.Register_PortB_Output_of_Memory_Primitives false \
  CONFIG.Use_RSTA_Pin false \
  CONFIG.Port_B_Clock 100 \
  CONFIG.Port_B_Write_Rate 50 \
  CONFIG.Port_B_Enable_Rate 100 \
  CONFIG.use_bram_block Stand_Alone \
] [get_bd_cells decode_data_a_5]
create_bd_cell -type ip -vlnv xilinx.com:ip:c_addsub:12.0 data_mux15
set_property -dict [list \
  CONFIG.A_Type Unsigned \
  CONFIG.B_Type Unsigned \
  CONFIG.A_Width 1 \
  CONFIG.B_Width 1 \
  CONFIG.Out_Width 1 \
  CONFIG.Latency 0 \
  CONFIG.B_Constant true \
  CONFIG.B_Value 0 \
  CONFIG.CE false \
  CONFIG.Bypass true \
] [get_bd_cells data_mux15]
create_bd_cell -type ip -vlnv xilinx.com:ip:util_vector_logic:2.0 data_ce_mux_bb_5
set_property -dict {CONFIG.C_SIZE 1} [get_bd_cells data_ce_mux_bb_5]
create_bd_cell -type ip -vlnv xilinx.com:ip:util_vector_logic:2.0 data_ce_mux_ab_5
set_property -dict {CONFIG.C_SIZE 1} [get_bd_cells data_ce_mux_ab_5]
create_bd_cell -type ip -vlnv xilinx.com:ip:blk_mem_gen:8.3 decode_data_b_6
set_property -dict [list \
  CONFIG.Memory_Type True_Dual_Port_RAM \
  CONFIG.Enable_32bit_Address false \
  CONFIG.Use_Byte_Write_Enable false \
  CONFIG.Write_Width_A 1 \
  CONFIG.Read_Width_A 1 \
  CONFIG.Write_Width_B 1 \
  CONFIG.Read_Width_B 1 \
  CONFIG.Enable_B Use_ENB_Pin \
  CONFIG.Register_PortA_Output_of_Memory_Primitives false \
  CONFIG.Register_PortB_Output_of_Memory_Primitives false \
  CONFIG.Use_RSTA_Pin false \
  CONFIG.Port_B_Clock 100 \
  CONFIG.Port_B_Write_Rate 50 \
  CONFIG.Port_B_Enable_Rate 100 \
  CONFIG.use_bram_block Stand_Alone \
] [get_bd_cells decode_data_b_6]
create_bd_cell -type ip -vlnv xilinx.com:ip:blk_mem_gen:8.3 decode_data_a_6
set_property -dict [list \
  CONFIG.Memory_Type True_Dual_Port_RAM \
  CONFIG.Enable_32bit_Address false \
  CONFIG.Use_Byte_Write_Enable false \
  CONFIG.Write_Width_A 1 \
  CONFIG.Read_Width_A 1 \
  CONFIG.Write_Width_B 1 \
  CONFIG.Read_Width_B 1 \
  CONFIG.Enable_B Use_ENB_Pin \
  CONFIG.Register_PortA_Output_of_Memory_Primitives false \
  CONFIG.Register_PortB_Output_of_Memory_Primitives false \
  CONFIG.Use_RSTA_Pin false \
  CONFIG.Port_B_Clock 100 \
  CONFIG.Port_B_Write_Rate 50 \
  CONFIG.Port_B_Enable_Rate 100 \
  CONFIG.use_bram_block Stand_Alone \
] [get_bd_cells decode_data_a_6]
create_bd_cell -type ip -vlnv xilinx.com:ip:util_vector_logic:2.0 data_ce_mux_bb_6
set_property -dict {CONFIG.C_SIZE 1} [get_bd_cells data_ce_mux_bb_6]
create_bd_cell -type ip -vlnv xilinx.com:ip:util_vector_logic:2.0 data_ce_mux_ab_6
set_property -dict {CONFIG.C_SIZE 1} [get_bd_cells data_ce_mux_ab_6]
create_bd_cell -type ip -vlnv xilinx.com:ip:c_addsub:12.0 data_mux16
set_property -dict [list \
  CONFIG.A_Type Unsigned \
  CONFIG.B_Type Unsigned \
  CONFIG.A_Width 1 \
  CONFIG.B_Width 1 \
  CONFIG.Out_Width 1 \
  CONFIG.Latency 0 \
  CONFIG.B_Constant true \
  CONFIG.B_Value 0 \
  CONFIG.CE false \
  CONFIG.Bypass true \
] [get_bd_cells data_mux16]
create_bd_cell -type ip -vlnv xilinx.com:ip:blk_mem_gen:8.3 decode_data_b_7
set_property -dict [list \
  CONFIG.Memory_Type True_Dual_Port_RAM \
  CONFIG.Enable_32bit_Address false \
  CONFIG.Use_Byte_Write_Enable false \
  CONFIG.Write_Width_A 1 \
  CONFIG.Read_Width_A 1 \
  CONFIG.Write_Width_B 1 \
  CONFIG.Read_Width_B 1 \
  CONFIG.Enable_B Use_ENB_Pin \
  CONFIG.Register_PortA_Output_of_Memory_Primitives false \
  CONFIG.Register_PortB_Output_of_Memory_Primitives false \
  CONFIG.Use_RSTA_Pin false \
  CONFIG.Port_B_Clock 100 \
  CONFIG.Port_B_Write_Rate 50 \
  CONFIG.Port_B_Enable_Rate 100 \
  CONFIG.use_bram_block Stand_Alone \
] [get_bd_cells decode_data_b_7]
create_bd_cell -type ip -vlnv xilinx.com:ip:blk_mem_gen:8.3 decode_data_a_7
set_property -dict [list \
  CONFIG.Memory_Type True_Dual_Port_RAM \
  CONFIG.Enable_32bit_Address false \
  CONFIG.Use_Byte_Write_Enable false \
  CONFIG.Write_Width_A 1 \
  CONFIG.Read_Width_A 1 \
  CONFIG.Write_Width_B 1 \
  CONFIG.Read_Width_B 1 \
  CONFIG.Enable_B Use_ENB_Pin \
  CONFIG.Register_PortA_Output_of_Memory_Primitives false \
  CONFIG.Register_PortB_Output_of_Memory_Primitives false \
  CONFIG.Use_RSTA_Pin false \
  CONFIG.Port_B_Clock 100 \
  CONFIG.Port_B_Write_Rate 50 \
  CONFIG.Port_B_Enable_Rate 100 \
  CONFIG.use_bram_block Stand_Alone \
] [get_bd_cells decode_data_a_7]
create_bd_cell -type ip -vlnv xilinx.com:ip:c_addsub:12.0 data_mux17
set_property -dict [list \
  CONFIG.A_Type Unsigned \
  CONFIG.B_Type Unsigned \
  CONFIG.A_Width 1 \
  CONFIG.B_Width 1 \
  CONFIG.Out_Width 1 \
  CONFIG.Latency 0 \
  CONFIG.B_Constant true \
  CONFIG.B_Value 0 \
  CONFIG.CE false \
  CONFIG.Bypass true \
] [get_bd_cells data_mux17]
create_bd_cell -type ip -vlnv xilinx.com:ip:util_vector_logic:2.0 data_ce_mux_bb_7
set_property -dict {CONFIG.C_SIZE 1} [get_bd_cells data_ce_mux_bb_7]
create_bd_cell -type ip -vlnv xilinx.com:ip:util_vector_logic:2.0 data_ce_mux_ab_7
set_property -dict {CONFIG.C_SIZE 1} [get_bd_cells data_ce_mux_ab_7]
create_bd_cell -type ip -vlnv xilinx.com:ip:xlconstant:1.1 xlconstant_3
set_property -dict {CONFIG.CONST_WIDTH 8 CONFIG.CONST_VAL 0} [get_bd_cells xlconstant_3]
create_bd_cell -type ip -vlnv xilinx.com:ip:c_addsub:12.0 itt_num_lat1
set_property -dict [list \
  CONFIG.A_Type Unsigned \
  CONFIG.B_Type Unsigned \
  CONFIG.A_Width 8 \
  CONFIG.B_Width 8 \
  CONFIG.Out_Width 8 \
  CONFIG.Latency 1 \
  CONFIG.B_Constant true \
  CONFIG.B_Value 00000000 \
] [get_bd_cells itt_num_lat1]
create_bd_cell -type ip -vlnv xilinx.com:ip:c_addsub:12.0 decode_start_lat1
set_property -dict [list \
  CONFIG.A_Type Unsigned \
  CONFIG.B_Type Unsigned \
  CONFIG.A_Width 1 \
  CONFIG.B_Width 1 \
  CONFIG.Out_Width 1 \
  CONFIG.Latency 1 \
  CONFIG.B_Constant true \
  CONFIG.B_Value 0 \
  CONFIG.SCLR true \
] [get_bd_cells decode_start_lat1]
create_bd_cell -type ip -vlnv xilinx.com:hls:HLSLdpcLogDecScaledMin:1.0 Decoder_A
create_bd_cell -type ip -vlnv xilinx.com:hls:HLSLdpcLogDecScaledMin:1.0 Decoder_B
create_bd_cell -type ip -vlnv xilinx.com:hls:LDPC_buff:1.0 LDPC_buff_0
create_bd_cell -type ip -vlnv xilinx.com:hls:LDPC_Out:1.0 LDPC_Out_0
